# Altium project DDR4.PrjPcb (part 1 of 2)
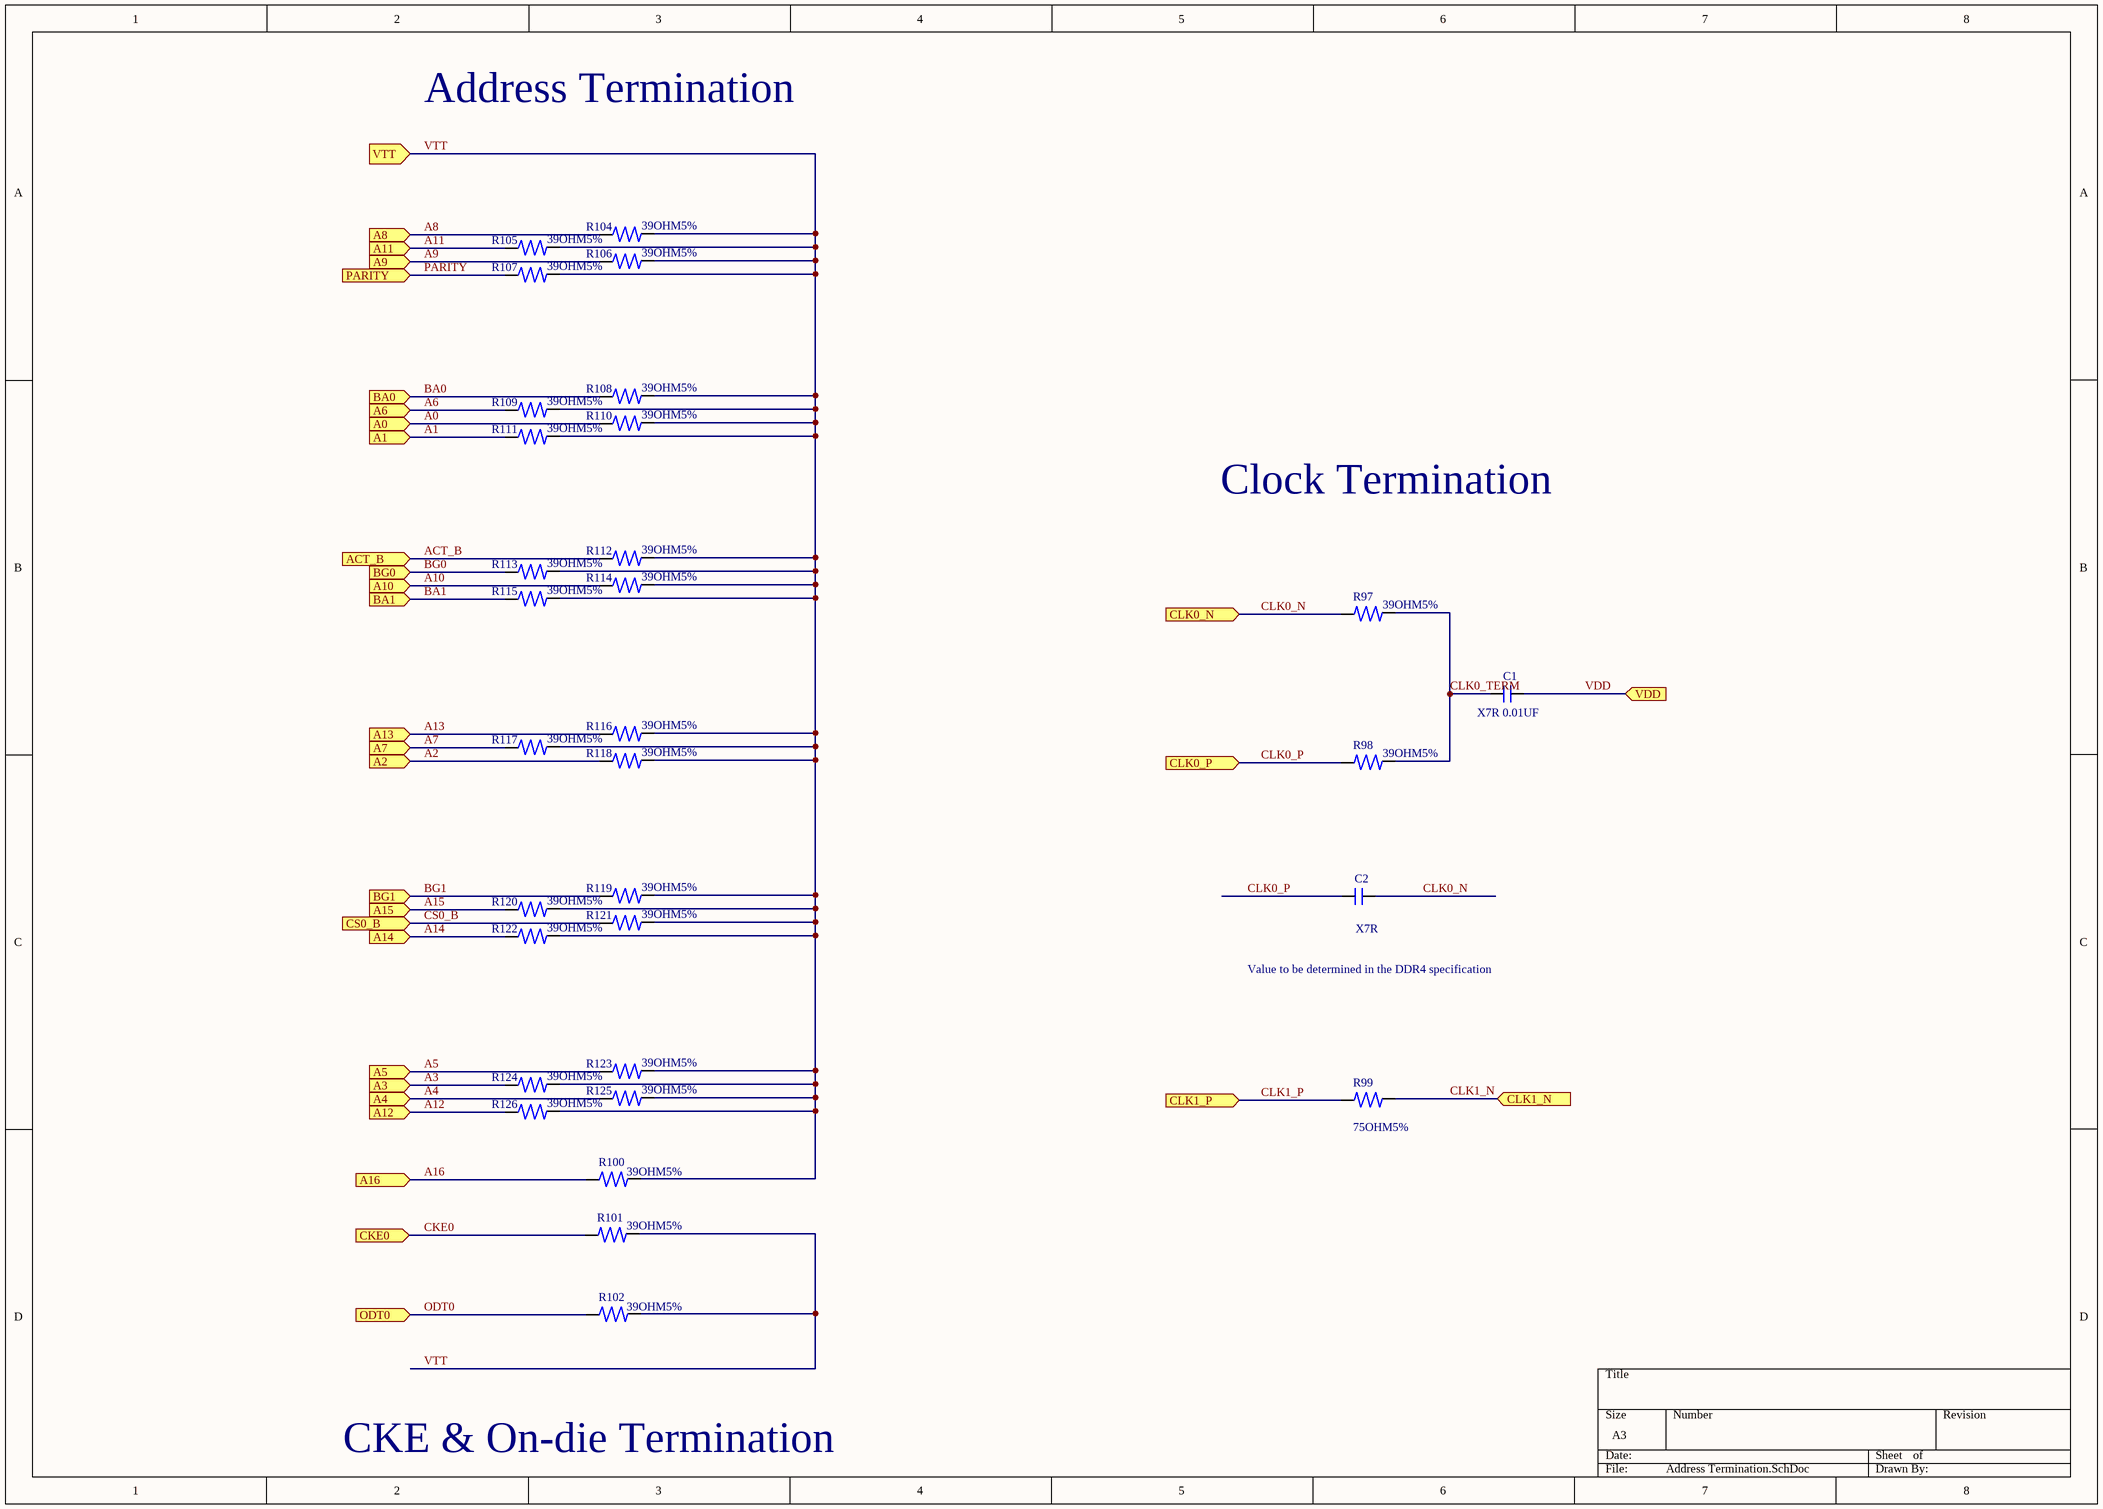
[diagram p0: Address Termination.SchDoc]
7 sheets, 198 parts. Net scope: flat (ports and power ports of the same name join across sheets).
Sheets:
  Address Termination.SchDoc
  Calibration.SchDoc
  Decap.SchDoc
  Memory Chips 5 to 8.SchDoc
  SPD and Alert.SchDoc
  Stub Termination.SchDoc
  Fiducial Markers.SchDoc

## Sheet Address Termination.SchDoc
size A3

### Parts
C1  Capacitance: X7R 0.01UF  [Capacitor 0402]  (hidden comment: Capacitor 0402)
C2  Capacitance: X7R  [Capacitor 0402]  (hidden comment: Capacitor 0402)
R97  Resistance: 39OHM5%  [Resistor 0402]  (hidden comment: Resistor 0402)
R98  Resistance: 39OHM5%  [Resistor 0402]  (hidden comment: Resistor 0402)
R99  Resistance: 75OHM5%  [Resistor 0402]  (hidden comment: Resistor 0402)
R100  Resistance: 39OHM5%  [Resistor 0402]  (hidden comment: Resistor 0402)
R101  Resistance: 39OHM5%  [Resistor 0402]  (hidden comment: Resistor 0402)
R102  Resistance: 39OHM5%  [Resistor 0402]  (hidden comment: Resistor 0402)
R104  Resistance: 39OHM5%  [Resistor 0402]  (hidden comment: Resistor 0402)
R105  Resistance: 39OHM5%  [Resistor 0402]  (hidden comment: Resistor 0402)
R106  Resistance: 39OHM5%  [Resistor 0402]  (hidden comment: Resistor 0402)
R107  Resistance: 39OHM5%  [Resistor 0402]  (hidden comment: Resistor 0402)
R108  Resistance: 39OHM5%  [Resistor 0402]  (hidden comment: Resistor 0402)
R109  Resistance: 39OHM5%  [Resistor 0402]  (hidden comment: Resistor 0402)
R110  Resistance: 39OHM5%  [Resistor 0402]  (hidden comment: Resistor 0402)
R111  Resistance: 39OHM5%  [Resistor 0402]  (hidden comment: Resistor 0402)
R112  Resistance: 39OHM5%  [Resistor 0402]  (hidden comment: Resistor 0402)
R113  Resistance: 39OHM5%  [Resistor 0402]  (hidden comment: Resistor 0402)
R114  Resistance: 39OHM5%  [Resistor 0402]  (hidden comment: Resistor 0402)
R115  Resistance: 39OHM5%  [Resistor 0402]  (hidden comment: Resistor 0402)
R116  Resistance: 39OHM5%  [Resistor 0402]  (hidden comment: Resistor 0402)
R117  Resistance: 39OHM5%  [Resistor 0402]  (hidden comment: Resistor 0402)
R118  Resistance: 39OHM5%  [Resistor 0402]  (hidden comment: Resistor 0402)
R119  Resistance: 39OHM5%  [Resistor 0402]  (hidden comment: Resistor 0402)
R120  Resistance: 39OHM5%  [Resistor 0402]  (hidden comment: Resistor 0402)
R121  Resistance: 39OHM5%  [Resistor 0402]  (hidden comment: Resistor 0402)
R122  Resistance: 39OHM5%  [Resistor 0402]  (hidden comment: Resistor 0402)
R123  Resistance: 39OHM5%  [Resistor 0402]  (hidden comment: Resistor 0402)
R124  Resistance: 39OHM5%  [Resistor 0402]  (hidden comment: Resistor 0402)
R125  Resistance: 39OHM5%  [Resistor 0402]  (hidden comment: Resistor 0402)
R126  Resistance: 39OHM5%  [Resistor 0402]  (hidden comment: Resistor 0402)

### Ports
A0 (in), A1 (in), A2 (in), A3 (in), A4 (in), A5 (in), A6 (in), A7 (in), A8 (in), A9 (in), A10 (in), A11 (in), A12 (in), A13 (in), A14 (in), A15 (in), A16 (in), ACT_B (in), BA0 (in), BA1 (in), BG0 (in), BG1 (in), CKE0 (in), CLK0_N (in), CLK0_P (in), CLK1_N (in), CLK1_P (in), CS0_B (in), ODT0 (in), PARITY (in), VDD (in), VTT (in)

### Nets
A0: R110.1 ; port A0
A1: R111.1 ; port A1
A2: R118.1 ; port A2
A3: R124.1 ; port A3
A4: R125.1 ; port A4
A5: R123.1 ; port A5
A6: R109.1 ; port A6
A7: R117.1 ; port A7
A8: R104.1 ; port A8
A9: R106.1 ; port A9
A10: R114.1 ; port A10
A11: R105.1 ; port A11
A12: R126.1 ; port A12
A13: R116.1 ; port A13
A14: R122.1 ; port A14
A15: R120.1 ; port A15
A16: R100.1 ; port A16
ACT_B: R112.1 ; port ACT_B
BA0: R108.1 ; port BA0
BA1: R115.1 ; port BA1
BG0: R113.1 ; port BG0
BG1: R119.1 ; port BG1
CKE0: R101.1 ; port CKE0
CLK0_N: C2.2 R97.1 ; port CLK0_N
CLK0_P: C2.1 R98.1 ; port CLK0_P
CLK0_TERM: C1.1 R97.2 R98.2
CLK1_N: R99.2 ; port CLK1_N
CLK1_P: R99.1 ; port CLK1_P
CS0_B: R121.1 ; port CS0_B
ODT0: R102.1 ; port ODT0
PARITY: R107.1 ; port PARITY
VDD: C1.2 ; port VDD
VTT: R100.2 R101.2 R102.2 R104.2 R105.2 R106.2 R107.2 R108.2 R109.2 R110.2 R111.2 R112.2 R113.2 R114.2 R115.2 R116.2 R117.2 R118.2 R119.2 R120.2 R121.2 R122.2 R123.2 R124.2 R125.2 R126.2 ; port VTT

### Notes on the sheet
- Address Termination
- Clock Termination
- Value to be determined in the DDR4 specification
- CKE & On-die Termination

### Library data of the parts
C1 C2 = Capacitor 0201: Manufacturer: Vishay; Manufacturer Part Number: CRCW060310K0FKEA; Max Power Dissipation: 100mW; Tolerance: 1%; Voltage Rating: 75V; Temperature Coefficient: 100ppm/°C; Supplier 1: Avnet Europe; Stock 1: 305000; Pricing 1: 5000=0.00444, 10000=0.00432, 20000=0.00421, 30000=0.0041, 40000=0.004 (EUR); Case/Package: 0201; Number of Pins: 2; Weight: 7.1E-05oz; Contact Plating: Tin,Lead; Case Code (Metric): 0603; Case Code (Imperial): 0201; Min Operating Temperature: -55°C; Max Operating Temperature: 155°C; Packaging: Tape and Reel; Package Quantity: 10; Termination: SMD/SMT; Power Rating: 100mW; Composition: Thick Film; Number of Terminations: 2; Military Standard: Not; Voltage Rating (DC): 75V; Features: Automotive AEC-Q200; Length: 1.55mm; Height: 0.45mm; Width: 0.033inch; Depth: 0.85mm; Radiation Hardening: No; REACH SVHC: Unknown; Lead Free: Lead Free
R97-R102 R104-R126 = Resistor 0201: Manufacturer: Vishay; Manufacturer Part Number: CRCW060310K0FKEA; Max Power Dissipation: 100mW; Tolerance: 1%; Voltage Rating: 75V; Temperature Coefficient: 100ppm/°C; Supplier 1: Avnet Europe; Stock 1: 305000; Pricing 1: 5000=0.00444, 10000=0.00432, 20000=0.00421, 30000=0.0041, 40000=0.004 (EUR); Case/Package: 0201; Number of Pins: 2; Weight: 7.1E-05oz; Contact Plating: Tin,Lead; Case Code (Metric): 0603; Case Code (Imperial): 0201; Min Operating Temperature: -55°C; Max Operating Temperature: 155°C; Packaging: Tape and Reel; Package Quantity: 10; Termination: SMD/SMT; Power Rating: 100mW; Composition: Thick Film; Number of Terminations: 2; Military Standard: Not; Voltage Rating (DC): 75V; Features: Automotive AEC-Q200; Length: 1.55mm; Height: 0.45mm; Width: 0.033inch; Depth: 0.85mm; Radiation Hardening: No; REACH SVHC: Unknown; Lead Free: Lead Free; ComponentLink1URL: http://www.vishay.com/docs/20008/dcrcw.pdf?src-supplier=Avnet+Europe; ComponentLink1Description: http://www.vishay.com/docs/20008/dcrcw.pdf?src-supplier=Avnet+Europe; ComponentLink2URL: https://www.verical.com/server-webapp/html/getDatasheet?partID=86831&src-supplier=Verical; ComponentLink2Description: https://www.verical.com/server-webapp/html/getDatasheet?partID=86831&src-supplier=Verical; ComponentLink3URL: http://www.farnell.com/datasheets/2310790.pdf?src-supplier=Allied+Electronics; ComponentLink3Description: http://www.farnell.com/datasheets/2310790.pdf?src-supplier=Allied+Electronics; ComponentLink4URL: http://www.vishay.com/docs/20035/dcrcwe3.pdf?src-supplier=Digi-Key; ComponentLink4Description: http://www.vishay.com/docs/20035/dcrcwe3.pdf?src-supplier=Digi-Key; ComponentLink5URL: http://www.farnell.com/datasheets/2310790.pdf?src-supplier=Mouser; ComponentLink5Description: http://www.farnell.com/datasheets/2310790.pdf?src-supplier=Mouser; ComponentLink6URL: http://www.farnell.com/datasheets/2310790.pdf?src-supplier=Element14; ComponentLink6Description: http://www.farnell.com/datasheets/2310790.pdf?src-supplier=Element14; ComponentLink7URL: http://www.farnell.com/datasheets/2310790.pdf?src-supplier=Avnet; ComponentLink7Description: http://www.farnell.com/datasheets/2310790.pdf?src-supplier=Avnet; ComponentLink8URL: http://www.vishay.com/docs/20035/dcrcwe3.pdf?src-supplier=Future+Electronics; ComponentLink8Description: http://www.vishay.com/docs/20035/dcrcwe3.pdf?src-supplier=Future+Electronics; ComponentLink9URL: http://uk.rs-online.com/webdocs/0d98/0900766b80d98afc.pdf?src-supplier=RSComponents; ComponentLink9Description: http://uk.rs-online.com/webdocs/0d98/0900766b80d98afc.pdf?src-supplier=RSComponents; ComponentLink10URL: http://www.farnell.com/datasheets/2310790.pdf?src-supplier=Distrelec; ComponentLink10Description: http://www.farnell.com/datasheets/2310790.pdf?src-supplier=Distrelec

## Sheet Calibration.SchDoc
size A3
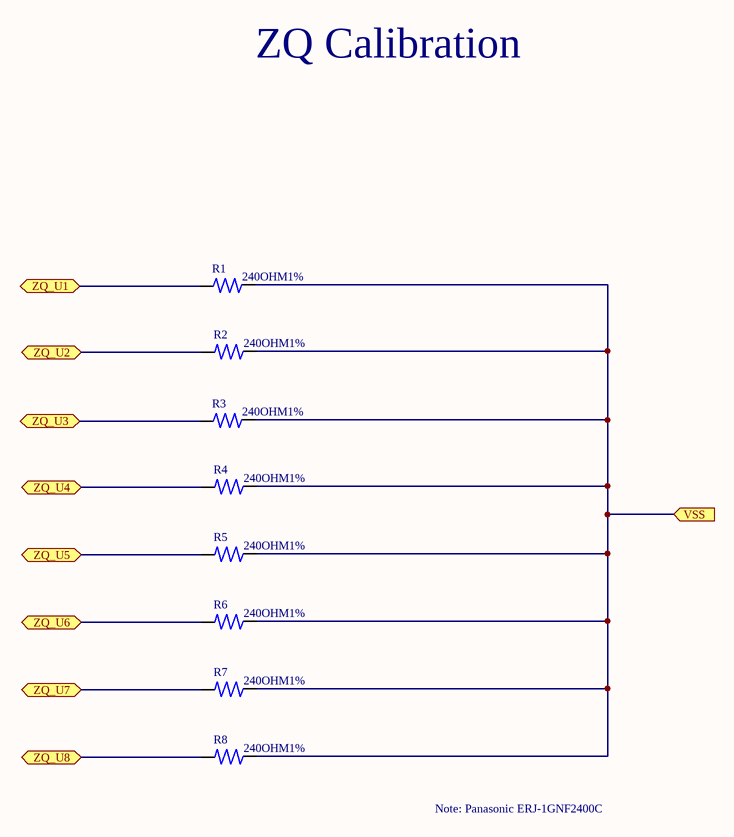
[diagram p1: Calibration.SchDoc]

### Parts
R1  Resistance: 240OHM1%  [Resistor 0402]  (hidden comment: Resistor 0402)
R2  Resistance: 240OHM1%  [Resistor 0402]  (hidden comment: Resistor 0402)
R3  Resistance: 240OHM1%  [Resistor 0402]  (hidden comment: Resistor 0402)
R4  Resistance: 240OHM1%  [Resistor 0402]  (hidden comment: Resistor 0402)
R5  Resistance: 240OHM1%  [Resistor 0402]  (hidden comment: Resistor 0402)
R6  Resistance: 240OHM1%  [Resistor 0402]  (hidden comment: Resistor 0402)
R7  Resistance: 240OHM1%  [Resistor 0402]  (hidden comment: Resistor 0402)
R8  Resistance: 240OHM1%  [Resistor 0402]  (hidden comment: Resistor 0402)

### Ports
VSS (in), ZQ_U1 (bidir), ZQ_U2 (bidir), ZQ_U3 (bidir), ZQ_U4 (bidir), ZQ_U5 (bidir), ZQ_U6 (bidir), ZQ_U7 (bidir), ZQ_U8 (bidir)

### Nets
VSS: R1.2 R2.2 R3.2 R4.2 R5.2 R6.2 R7.2 R8.2 ; port VSS
ZQ_U5: R5.1 ; port ZQ_U5
ZQ_U6: R6.1 ; port ZQ_U6
ZQ_U7: R7.1 ; port ZQ_U7
ZQ_U8: R8.1 ; port ZQ_U8
NetR1_1: R1.1 ; port ZQ_U1
NetR2_1: R2.1 ; port ZQ_U2
NetR3_1: R3.1 ; port ZQ_U3
NetR4_1: R4.1 ; port ZQ_U4

### Notes on the sheet
- ZQ Calibration
- Note: Panasonic ERJ-1GNF2400C

### Library data of the parts
R1-R8 = Resistor 0201: as R97 on sheet Address Termination; Supplier 1: Avnet Europe; Stock 1: 305000; Pricing 1: 5000=0.00444, 10000=0.00432, 20000=0.00421, 30000=0.0041, 40000=0.004 (EUR); Case/Package: 0201; Number of Pins: 2; Weight: 7.1E-05oz; Contact Plating: Tin,Lead; Case Code (Metric): 0603; Case Code (Imperial): 0201; Min Operating Temperature: -55°C; Max Operating Temperature: 155°C; Packaging: Tape and Reel; Package Quantity: 10; Termination: SMD/SMT; Power Rating: 100mW; Composition: Thick Film; Number of Terminations: 2; Military Standard: Not; Voltage Rating (DC): 75V; Features: Automotive AEC-Q200; Length: 1.55mm; Height: 0.45mm; Width: 0.033inch; Depth: 0.85mm; Radiation Hardening: No; REACH SVHC: Unknown; Lead Free: Lead Free; ComponentLink1URL: http://www.vishay.com/docs/20008/dcrcw.pdf?src-supplier=Avnet+Europe; ComponentLink1Description: http://www.vishay.com/docs/20008/dcrcw.pdf?src-supplier=Avnet+Europe; ComponentLink2URL: https://www.verical.com/server-webapp/html/getDatasheet?partID=86831&src-supplier=Verical; ComponentLink2Description: https://www.verical.com/server-webapp/html/getDatasheet?partID=86831&src-supplier=Verical; ComponentLink3URL: http://www.farnell.com/datasheets/2310790.pdf?src-supplier=Allied+Electronics; ComponentLink3Description: http://www.farnell.com/datasheets/2310790.pdf?src-supplier=Allied+Electronics; ComponentLink4URL: http://www.vishay.com/docs/20035/dcrcwe3.pdf?src-supplier=Digi-Key; ComponentLink4Description: http://www.vishay.com/docs/20035/dcrcwe3.pdf?src-supplier=Digi-Key; ComponentLink5URL: http://www.farnell.com/datasheets/2310790.pdf?src-supplier=Mouser; ComponentLink5Description: http://www.farnell.com/datasheets/2310790.pdf?src-supplier=Mouser; ComponentLink6URL: http://www.farnell.com/datasheets/2310790.pdf?src-supplier=Element14; ComponentLink6Description: http://www.farnell.com/datasheets/2310790.pdf?src-supplier=Element14; ComponentLink7URL: http://www.farnell.com/datasheets/2310790.pdf?src-supplier=Avnet; ComponentLink7Description: http://www.farnell.com/datasheets/2310790.pdf?src-supplier=Avnet; ComponentLink8URL: http://www.vishay.com/docs/20035/dcrcwe3.pdf?src-supplier=Future+Electronics; ComponentLink8Description: http://www.vishay.com/docs/20035/dcrcwe3.pdf?src-supplier=Future+Electronics; ComponentLink9URL: http://uk.rs-online.com/webdocs/0d98/0900766b80d98afc.pdf?src-supplier=RSComponents; ComponentLink9Description: http://uk.rs-online.com/webdocs/0d98/0900766b80d98afc.pdf?src-supplier=RSComponents; ComponentLink10URL: http://www.farnell.com/datasheets/2310790.pdf?src-supplier=Distrelec; ComponentLink10Description: http://www.farnell.com/datasheets/2310790.pdf?src-supplier=Distrelec

## Sheet Decap.SchDoc
size A3
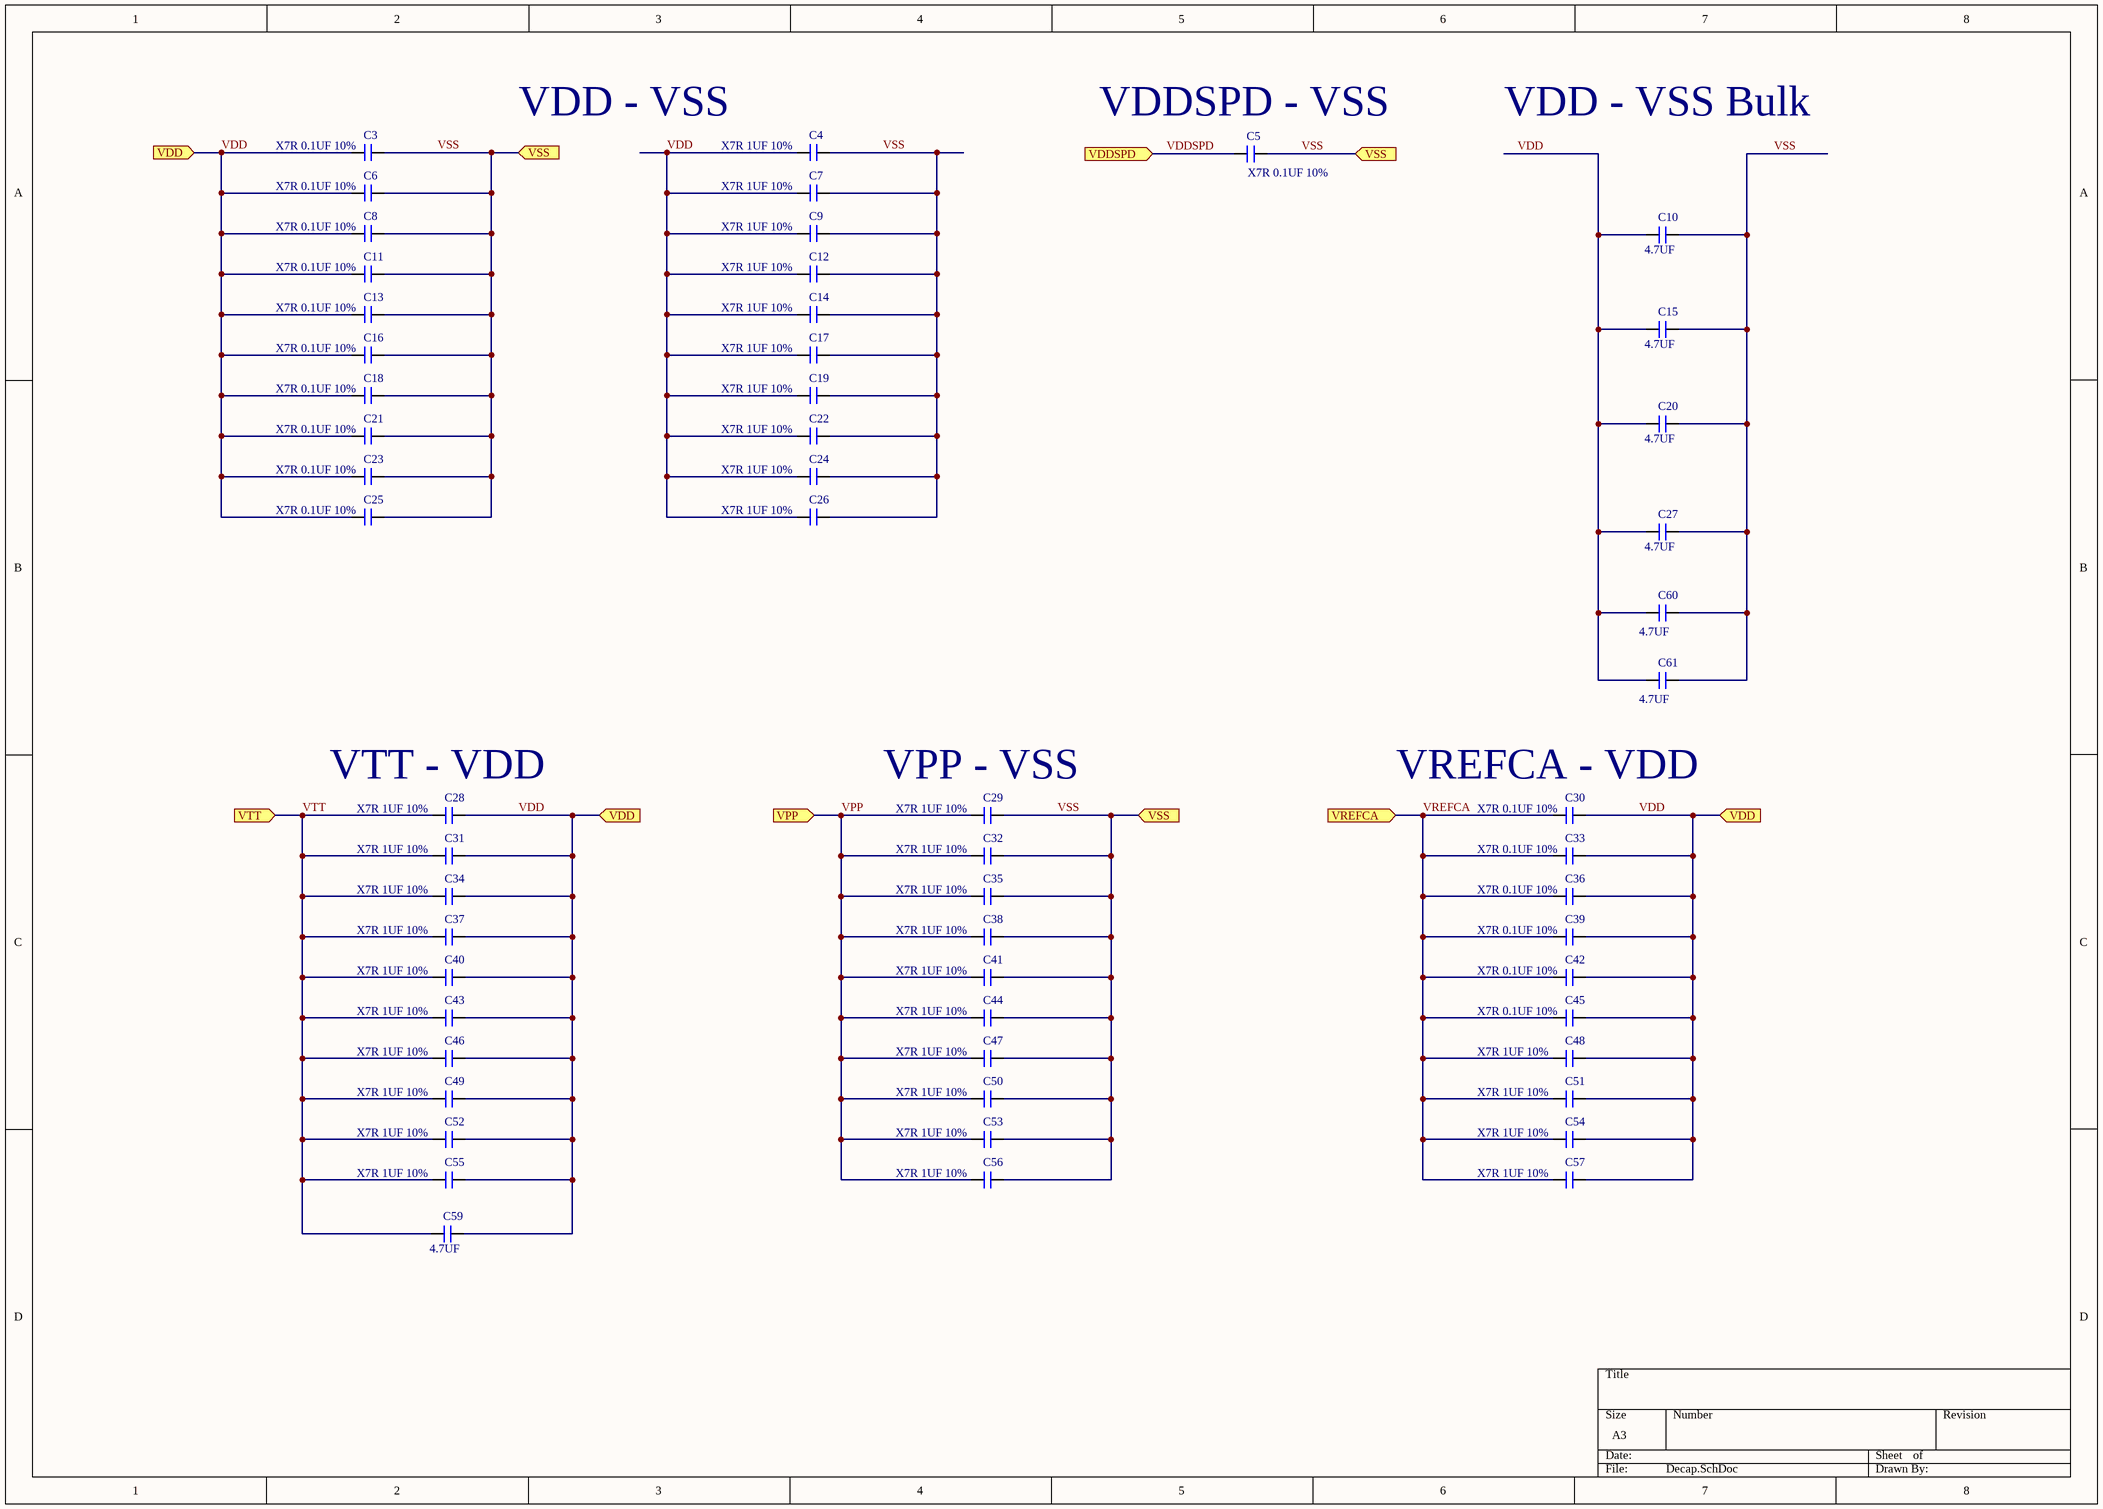
[diagram p2: Decap.SchDoc]

### Parts
C3  Capacitance: X7R 0.1UF 10%  [Capacitor 0402]  (hidden comment: Capacitor 0402)
C4  Capacitance: X7R 1UF 10%  [Capacitor 0402]  (hidden comment: Capacitor 0402)
C5  Capacitance: X7R 0.1UF 10%  [Capacitor 0402]  (hidden comment: Capacitor 0402)
C6  Capacitance: X7R 0.1UF 10%  [Capacitor 0402]  (hidden comment: Capacitor 0402)
C7  Capacitance: X7R 1UF 10%  [Capacitor 0402]  (hidden comment: Capacitor 0402)
C8  Capacitance: X7R 0.1UF 10%  [Capacitor 0402]  (hidden comment: Capacitor 0402)
C9  Capacitance: X7R 1UF 10%  [Capacitor 0402]  (hidden comment: Capacitor 0402)
C10  Capacitance: 4.7UF  [Capacitor 0603]  (hidden comment: Capacitor 0603)
C11  Capacitance: X7R 0.1UF 10%  [Capacitor 0402]  (hidden comment: Capacitor 0402)
C12  Capacitance: X7R 1UF 10%  [Capacitor 0402]  (hidden comment: Capacitor 0402)
C13  Capacitance: X7R 0.1UF 10%  [Capacitor 0402]  (hidden comment: Capacitor 0402)
C14  Capacitance: X7R 1UF 10%  [Capacitor 0402]  (hidden comment: Capacitor 0402)
C15  Capacitance: 4.7UF  [Capacitor 0603]  (hidden comment: Capacitor 0603)
C16  Capacitance: X7R 0.1UF 10%  [Capacitor 0402]  (hidden comment: Capacitor 0402)
C17  Capacitance: X7R 1UF 10%  [Capacitor 0402]  (hidden comment: Capacitor 0402)
C18  Capacitance: X7R 0.1UF 10%  [Capacitor 0402]  (hidden comment: Capacitor 0402)
C19  Capacitance: X7R 1UF 10%  [Capacitor 0402]  (hidden comment: Capacitor 0402)
C20  Capacitance: 4.7UF  [Capacitor 0603]  (hidden comment: Capacitor 0603)
C21  Capacitance: X7R 0.1UF 10%  [Capacitor 0402]  (hidden comment: Capacitor 0402)
C22  Capacitance: X7R 1UF 10%  [Capacitor 0402]  (hidden comment: Capacitor 0402)
C23  Capacitance: X7R 0.1UF 10%  [Capacitor 0402]  (hidden comment: Capacitor 0402)
C24  Capacitance: X7R 1UF 10%  [Capacitor 0402]  (hidden comment: Capacitor 0402)
C25  Capacitance: X7R 0.1UF 10%  [Capacitor 0402]  (hidden comment: Capacitor 0402)
C26  Capacitance: X7R 1UF 10%  [Capacitor 0402]  (hidden comment: Capacitor 0402)
C27  Capacitance: 4.7UF  [Capacitor 0603]  (hidden comment: Capacitor 0603)
C28  Capacitance: X7R 1UF 10%  [Capacitor 0402]  (hidden comment: Capacitor 0402)
C29  Capacitance: X7R 1UF 10%  [Capacitor 0402]  (hidden comment: Capacitor 0402)
C30  Capacitance: X7R 0.1UF 10%  [Capacitor 0402]  (hidden comment: Capacitor 0402)
C31  Capacitance: X7R 1UF 10%  [Capacitor 0402]  (hidden comment: Capacitor 0402)
C32  Capacitance: X7R 1UF 10%  [Capacitor 0402]  (hidden comment: Capacitor 0402)
C33  Capacitance: X7R 0.1UF 10%  [Capacitor 0402]  (hidden comment: Capacitor 0402)
C34  Capacitance: X7R 1UF 10%  [Capacitor 0402]  (hidden comment: Capacitor 0402)
C35  Capacitance: X7R 1UF 10%  [Capacitor 0402]  (hidden comment: Capacitor 0402)
C36  Capacitance: X7R 0.1UF 10%  [Capacitor 0402]  (hidden comment: Capacitor 0402)
C37  Capacitance: X7R 1UF 10%  [Capacitor 0402]  (hidden comment: Capacitor 0402)
C38  Capacitance: X7R 1UF 10%  [Capacitor 0402]  (hidden comment: Capacitor 0402)
C39  Capacitance: X7R 0.1UF 10%  [Capacitor 0402]  (hidden comment: Capacitor 0402)
C40  Capacitance: X7R 1UF 10%  [Capacitor 0402]  (hidden comment: Capacitor 0402)
C41  Capacitance: X7R 1UF 10%  [Capacitor 0402]  (hidden comment: Capacitor 0402)
C42  Capacitance: X7R 0.1UF 10%  [Capacitor 0402]  (hidden comment: Capacitor 0402)
C43  Capacitance: X7R 1UF 10%  [Capacitor 0402]  (hidden comment: Capacitor 0402)
C44  Capacitance: X7R 1UF 10%  [Capacitor 0402]  (hidden comment: Capacitor 0402)
C45  Capacitance: X7R 0.1UF 10%  [Capacitor 0402]  (hidden comment: Capacitor 0402)
C46  Capacitance: X7R 1UF 10%  [Capacitor 0402]  (hidden comment: Capacitor 0402)
C47  Capacitance: X7R 1UF 10%  [Capacitor 0402]  (hidden comment: Capacitor 0402)
C48  Capacitance: X7R 1UF 10%  [Capacitor 0402]  (hidden comment: Capacitor 0402)
C49  Capacitance: X7R 1UF 10%  [Capacitor 0402]  (hidden comment: Capacitor 0402)
C50  Capacitance: X7R 1UF 10%  [Capacitor 0402]  (hidden comment: Capacitor 0402)
C51  Capacitance: X7R 1UF 10%  [Capacitor 0402]  (hidden comment: Capacitor 0402)
C52  Capacitance: X7R 1UF 10%  [Capacitor 0402]  (hidden comment: Capacitor 0402)
C53  Capacitance: X7R 1UF 10%  [Capacitor 0402]  (hidden comment: Capacitor 0402)
C54  Capacitance: X7R 1UF 10%  [Capacitor 0402]  (hidden comment: Capacitor 0402)
C55  Capacitance: X7R 1UF 10%  [Capacitor 0402]  (hidden comment: Capacitor 0402)
C56  Capacitance: X7R 1UF 10%  [Capacitor 0402]  (hidden comment: Capacitor 0402)
C57  Capacitance: X7R 1UF 10%  [Capacitor 0402]  (hidden comment: Capacitor 0402)
C59  Capacitance: 4.7UF  [Capacitor 0603]  (hidden comment: Capacitor 0603)
C60  Capacitance: 4.7UF  [Capacitor 0603]  (hidden comment: Capacitor 0603)
C61  Capacitance: 4.7UF  [Capacitor 0603]  (hidden comment: Capacitor 0603)

### Ports
VDD (in), VDDSPD (in), VPP (in), VREFCA (in), VSS (in), VTT (in)

### Nets
VDD: C3.1 C4.1 C6.1 C7.1 C8.1 C9.1 C10.1 C11.1 C12.1 C13.1 C14.1 C15.1 C16.1 C17.1 C18.1 C19.1 C20.1 C21.1 C22.1 C23.1 C24.1 C25.1 C26.1 C27.1 C28.2 C30.2 C31.2 C33.2 C34.2 C36.2 C37.2 C39.2 C40.2 C42.2 C43.2 C45.2 C46.2 C48.2 C49.2 C51.2 C52.2 C54.2 C55.2 C57.2 C59.2 C60.1 C61.1 ; port VDD
VDDSPD: C5.1 ; port VDDSPD
VPP: C29.1 C32.1 C35.1 C38.1 C41.1 C44.1 C47.1 C50.1 C53.1 C56.1 ; port VPP
VREFCA: C30.1 C33.1 C36.1 C39.1 C42.1 C45.1 C48.1 C51.1 C54.1 C57.1 ; port VREFCA
VSS: C3.2 C4.2 C5.2 C6.2 C7.2 C8.2 C9.2 C10.2 C11.2 C12.2 C13.2 C14.2 C15.2 C16.2 C17.2 C18.2 C19.2 C20.2 C21.2 C22.2 C23.2 C24.2 C25.2 C26.2 C27.2 C29.2 C32.2 C35.2 C38.2 C41.2 C44.2 C47.2 C50.2 C53.2 C56.2 C60.2 C61.2 ; port VSS
VTT: C28.1 C31.1 C34.1 C37.1 C40.1 C43.1 C46.1 C49.1 C52.1 C55.1 C59.1 ; port VTT

### Notes on the sheet
- VDD - VSS
- (near C5) VDDSPD - VSS
- VDD - VSS Bulk
- (near C28) VTT - VDD
- (near C29) VPP - VSS
- (near C30) VREFCA - VDD

### Library data of the parts
C3-C9 C11-C14 C16-C19 C21-C26 C28-C57 = Capacitor 0201: as C1 on sheet Address Termination; Supplier 1: Avnet Europe; Stock 1: 305000; Pricing 1: 5000=0.00444, 10000=0.00432, 20000=0.00421, 30000=0.0041, 40000=0.004 (EUR); Case/Package: 0201; Number of Pins: 2; Weight: 7.1E-05oz; Contact Plating: Tin,Lead; Case Code (Metric): 0603; Case Code (Imperial): 0201; Min Operating Temperature: -55°C; Max Operating Temperature: 155°C; Packaging: Tape and Reel; Package Quantity: 10; Termination: SMD/SMT; Power Rating: 100mW; Composition: Thick Film; Number of Terminations: 2; Military Standard: Not; Voltage Rating (DC): 75V; Features: Automotive AEC-Q200; Length: 1.55mm; Height: 0.45mm; Width: 0.033inch; Depth: 0.85mm; Radiation Hardening: No; REACH SVHC: Unknown; Lead Free: Lead Free
C10 C15 C20 C27 C59-C61 = Capacitor 0603: Manufacturer: Vishay; Manufacturer Part Number: CRCW060310K0FKEA; Max Power Dissipation: 100mW; Tolerance: 1%; Voltage Rating: 75V; Temperature Coefficient: 100ppm/°C; Supplier 1: Avnet Europe; Stock 1: 305000; Pricing 1: 5000=0.00444, 10000=0.00432, 20000=0.00421, 30000=0.0041, 40000=0.004 (EUR); Case/Package: 0603; Number of Pins: 2; Weight: 7.1E-05oz; Contact Plating: Tin,Lead; Case Code (Metric): 1608; Case Code (Imperial): 0603; Min Operating Temperature: -55°C; Max Operating Temperature: 155°C; Packaging: Tape and Reel; Package Quantity: 10; Termination: SMD/SMT; Power Rating: 100mW; Composition: Thick Film; Number of Terminations: 2; Military Standard: Not; Voltage Rating (DC): 75V; Features: Automotive AEC-Q200; Length: 1.55mm; Height: 0.45mm; Width: 0.033inch; Depth: 0.85mm; Radiation Hardening: No; REACH SVHC: Unknown; Lead Free: Lead Free

## Sheet Memory Chips 5 to 8.SchDoc
size A3
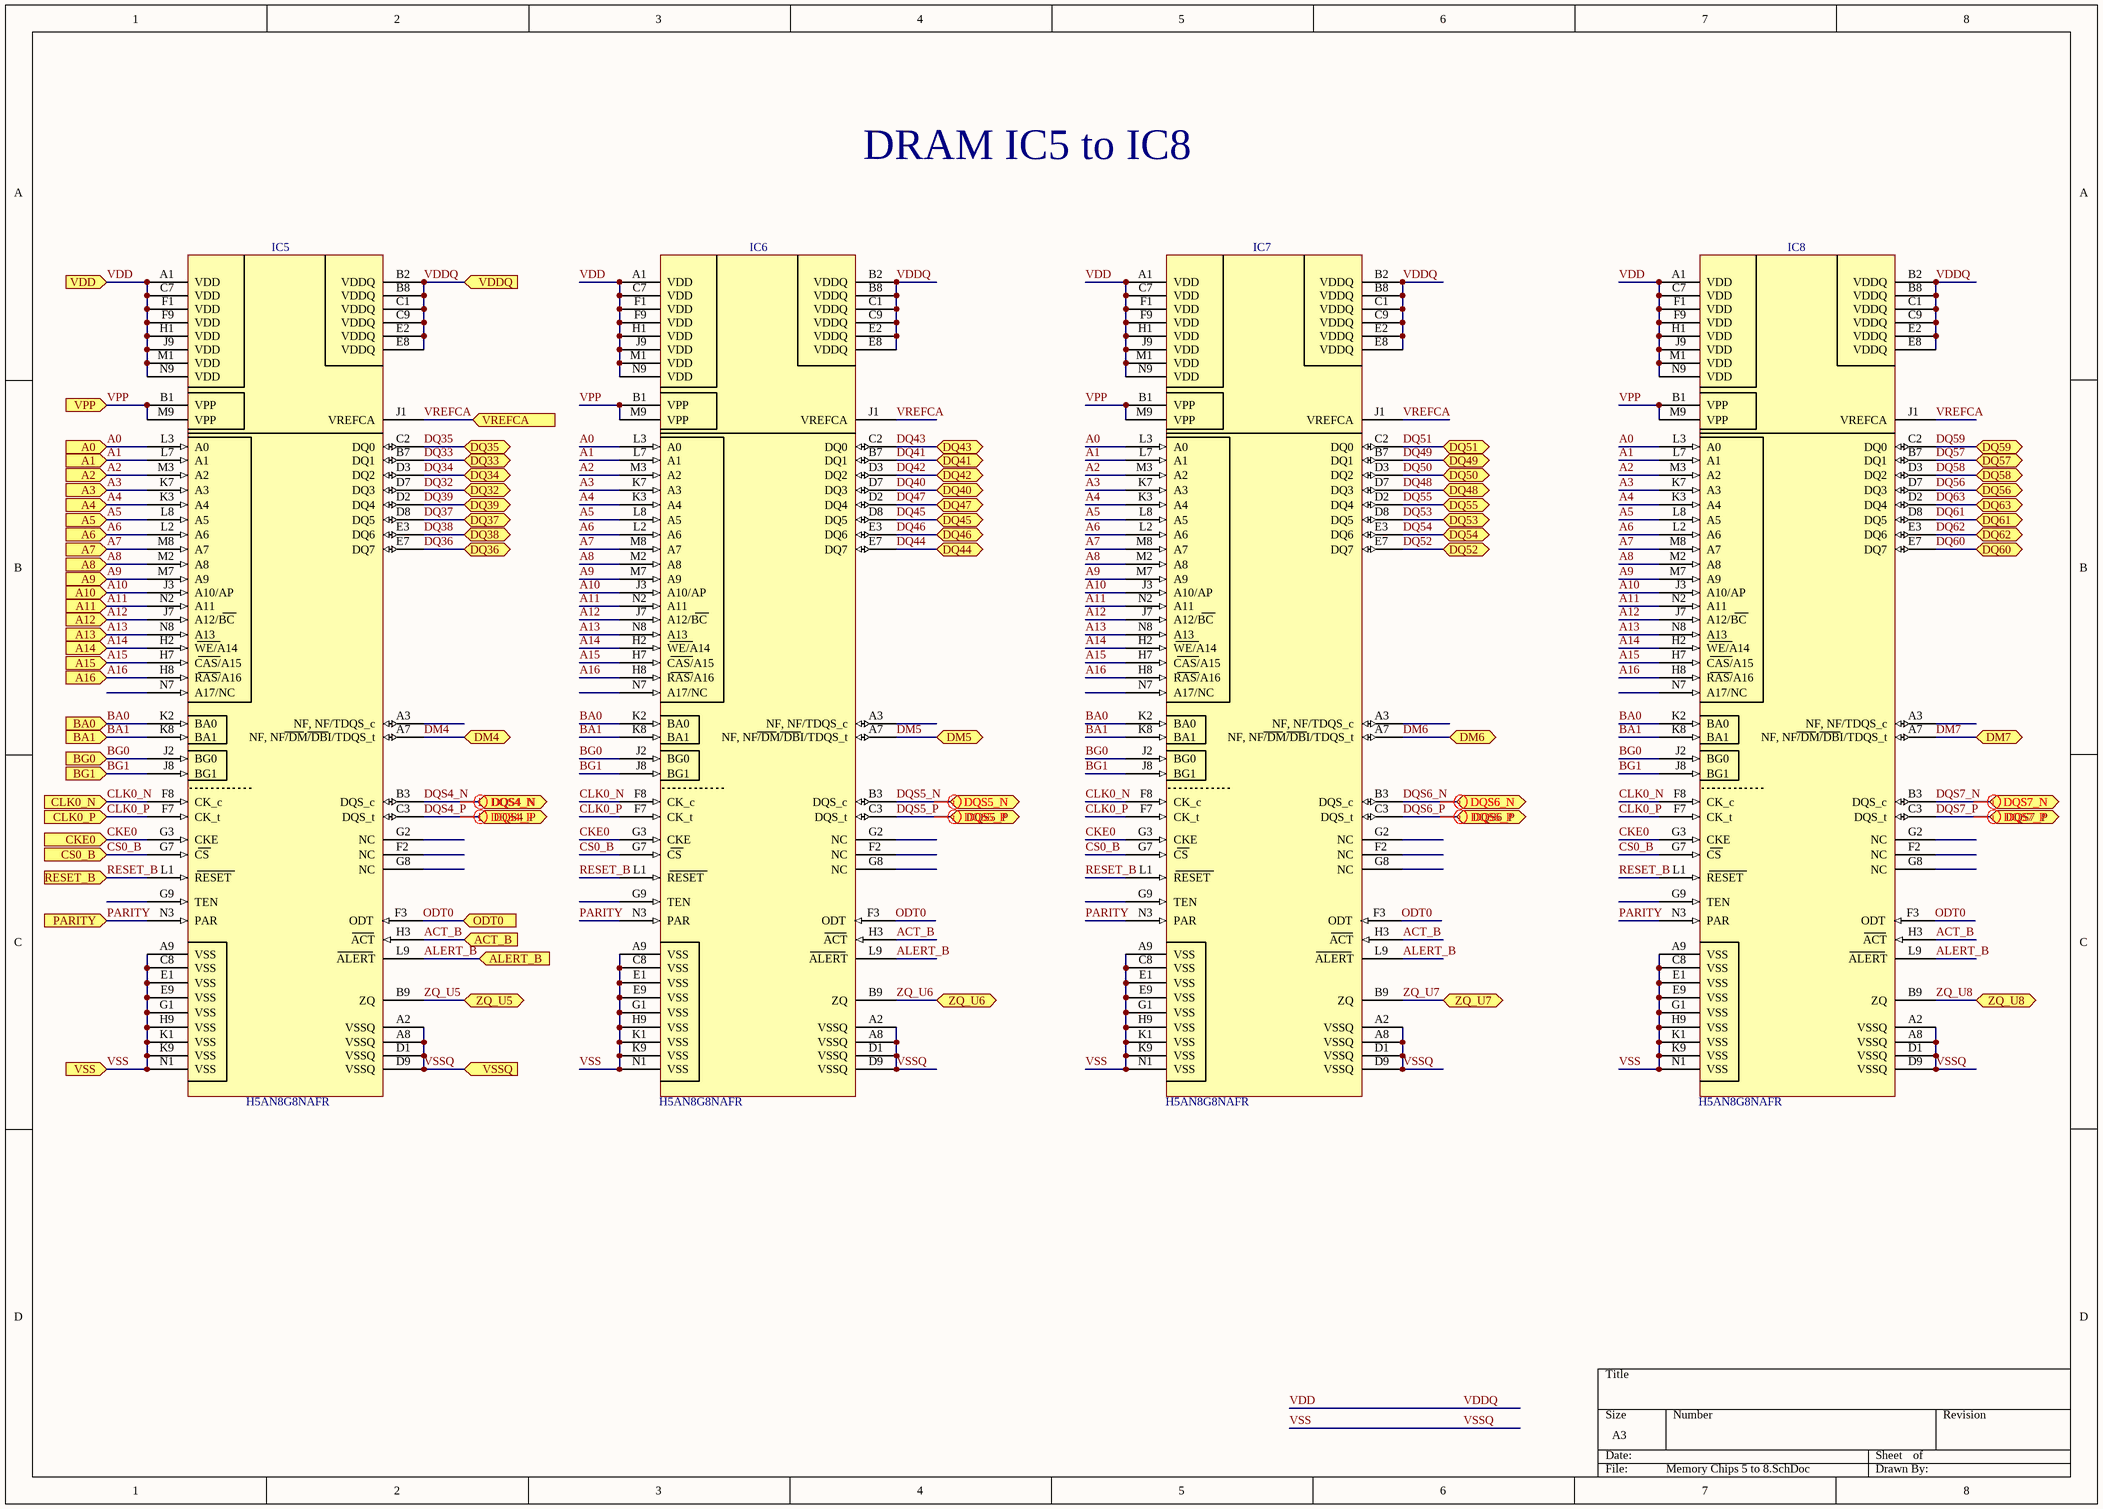
[diagram p3: Memory Chips 5 to 8.SchDoc]

### Parts
IC5  H5AN8G8NAFR  [H5AN8G8NAFR]
IC6  H5AN8G8NAFR  [H5AN8G8NAFR]
IC7  H5AN8G8NAFR  [H5AN8G8NAFR]
IC8  H5AN8G8NAFR  [H5AN8G8NAFR]

### Ports
A0 (in), A1 (in), A2 (in), A3 (in), A4 (in), A5 (in), A6 (in), A7 (in), A8 (in), A9 (in), A10 (in), A11 (in), A12 (in), A13 (in), A14 (in), A15 (in), A16 (in), ACT_B (in), ALERT_B (in), BA0 (in), BA1 (in), BG0 (in), BG1 (in), CKE0 (in), CLK0_N (in), CLK0_P (in), CS0_B (in), DM4 (bidir), DM5 (bidir), DM6 (bidir), DM7 (bidir), DQ32 (bidir), DQ33 (bidir), DQ34 (bidir), DQ35 (bidir), DQ36 (bidir), DQ37 (bidir), DQ38 (bidir), DQ39 (bidir), DQ40 (bidir), DQ41 (bidir), DQ42 (bidir), DQ43 (bidir), DQ44 (bidir), DQ45 (bidir), DQ46 (bidir), DQ47 (bidir), DQ48 (bidir), DQ49 (bidir), DQ50 (bidir), DQ51 (bidir), DQ52 (bidir), DQ53 (bidir), DQ54 (bidir), DQ55 (bidir), DQ56 (bidir), DQ57 (bidir), DQ58 (bidir), DQ59 (bidir), DQ60 (bidir), DQ61 (bidir), DQ62 (bidir), DQ63 (bidir), DQS4_N (bidir), DQS4_P (bidir), DQS5_N (bidir), DQS5_P (bidir), DQS6_N (bidir), DQS6_P (bidir), DQS7_N (bidir), DQS7_P (bidir), ODT0 (in), PARITY (in), RESET_B (in), VDD (in), VDDQ (in), VPP (in), VREFCA (in), VSS (in), VSSQ (in), ZQ_U5 (bidir), ZQ_U6 (bidir), ZQ_U7 (bidir), ZQ_U8 (bidir)

### Nets
A0: IC5.L3(A0) IC6.L3(A0) IC7.L3(A0) IC8.L3(A0) ; port A0
A1: IC5.L7(A1) IC6.L7(A1) IC7.L7(A1) IC8.L7(A1) ; port A1
A2: IC5.M3(A2) IC6.M3(A2) IC7.M3(A2) IC8.M3(A2) ; port A2
A3: IC5.K7(A3) IC6.K7(A3) IC7.K7(A3) IC8.K7(A3) ; port A3
A4: IC5.K3(A4) IC6.K3(A4) IC7.K3(A4) IC8.K3(A4) ; port A4
A5: IC5.L8(A5) IC6.L8(A5) IC7.L8(A5) IC8.L8(A5) ; port A5
A6: IC5.L2(A6) IC6.L2(A6) IC7.L2(A6) IC8.L2(A6) ; port A6
A7: IC5.M8(A7) IC6.M8(A7) IC7.M8(A7) IC8.M8(A7) ; port A7
A8: IC5.M2(A8) IC6.M2(A8) IC7.M2(A8) IC8.M2(A8) ; port A8
A9: IC5.M7(A9) IC6.M7(A9) IC7.M7(A9) IC8.M7(A9) ; port A9
A10: IC5.J3(A10/AP) IC6.J3(A10/AP) IC7.J3(A10/AP) IC8.J3(A10/AP) ; port A10
A11: IC5.N2(A11) IC6.N2(A11) IC7.N2(A11) IC8.N2(A11) ; port A11
A12: IC5.J7(A12/BC) IC6.J7(A12/BC) IC7.J7(A12/BC) IC8.J7(A12/BC) ; port A12
A13: IC5.N8(A13) IC6.N8(A13) IC7.N8(A13) IC8.N8(A13) ; port A13
A14: IC5.H2(WE/A14) IC6.H2(WE/A14) IC7.H2(WE/A14) IC8.H2(WE/A14) ; port A14
A15: IC5.H7(CAS/A15) IC6.H7(CAS/A15) IC7.H7(CAS/A15) IC8.H7(CAS/A15) ; port A15
A16: IC5.H8(RAS/A16) IC6.H8(RAS/A16) IC7.H8(RAS/A16) IC8.H8(RAS/A16) ; port A16
ACT_B: IC5.H3(ACT) IC6.H3(ACT) IC7.H3(ACT) IC8.H3(ACT) ; port ACT_B
ALERT_B: IC5.L9(ALERT) IC6.L9(ALERT) IC7.L9(ALERT) IC8.L9(ALERT) ; port ALERT_B
BA0: IC5.K2(BA0) IC6.K2(BA0) IC7.K2(BA0) IC8.K2(BA0) ; port BA0
BA1: IC5.K8(BA1) IC6.K8(BA1) IC7.K8(BA1) IC8.K8(BA1) ; port BA1
BG0: IC5.J2(BG0) IC6.J2(BG0) IC7.J2(BG0) IC8.J2(BG0) ; port BG0
BG1: IC5.J8(BG1) IC6.J8(BG1) IC7.J8(BG1) IC8.J8(BG1) ; port BG1
CKE0: IC5.G3(CKE) IC6.G3(CKE) IC7.G3(CKE) IC8.G3(CKE) ; port CKE0
CLK0_N: IC5.F8(CK_c) IC6.F8(CK_c) IC7.F8(CK_c) IC8.F8(CK_c) ; port CLK0_N
CLK0_P: IC5.F7(CK_t) IC6.F7(CK_t) IC7.F7(CK_t) IC8.F7(CK_t) ; port CLK0_P
CS0_B: IC5.G7(CS) IC6.G7(CS) IC7.G7(CS) IC8.G7(CS) ; port CS0_B
DM4: IC5.A7(NF,_NF/DM/DBI/TDQS_t) ; port DM4
DM5: IC6.A7(NF,_NF/DM/DBI/TDQS_t) ; port DM5
DM6: IC7.A7(NF,_NF/DM/DBI/TDQS_t) ; port DM6
DM7: IC8.A7(NF,_NF/DM/DBI/TDQS_t) ; port DM7
DQ32: IC5.D7(DQ3) ; port DQ32
DQ33: IC5.B7(DQ1) ; port DQ33
DQ34: IC5.D3(DQ2) ; port DQ34
DQ35: IC5.C2(DQ0) ; port DQ35
DQ36: IC5.E7(DQ7) ; port DQ36
DQ37: IC5.D8(DQ5) ; port DQ37
DQ38: IC5.E3(DQ6) ; port DQ38
DQ39: IC5.D2(DQ4) ; port DQ39
DQ40: IC6.D7(DQ3) ; port DQ40
DQ41: IC6.B7(DQ1) ; port DQ41
DQ42: IC6.D3(DQ2) ; port DQ42
DQ43: IC6.C2(DQ0) ; port DQ43
DQ44: IC6.E7(DQ7) ; port DQ44
DQ45: IC6.D8(DQ5) ; port DQ45
DQ46: IC6.E3(DQ6) ; port DQ46
DQ47: IC6.D2(DQ4) ; port DQ47
DQ48: IC7.D7(DQ3) ; port DQ48
DQ49: IC7.B7(DQ1) ; port DQ49
DQ50: IC7.D3(DQ2) ; port DQ50
DQ51: IC7.C2(DQ0) ; port DQ51
DQ52: IC7.E7(DQ7) ; port DQ52
DQ53: IC7.D8(DQ5) ; port DQ53
DQ54: IC7.E3(DQ6) ; port DQ54
DQ55: IC7.D2(DQ4) ; port DQ55
DQ56: IC8.D7(DQ3) ; port DQ56
DQ57: IC8.B7(DQ1) ; port DQ57
DQ58: IC8.D3(DQ2) ; port DQ58
DQ59: IC8.C2(DQ0) ; port DQ59
DQ60: IC8.E7(DQ7) ; port DQ60
DQ61: IC8.D8(DQ5) ; port DQ61
DQ62: IC8.E3(DQ6) ; port DQ62
DQ63: IC8.D2(DQ4) ; port DQ63
DQS4_N: IC5.B3(DQS_c) ; port DQS4_N
DQS4_P: IC5.C3(DQS_t) ; port DQS4_P
DQS5_N: IC6.B3(DQS_c) ; port DQS5_N
DQS5_P: IC6.C3(DQS_t) ; port DQS5_P
DQS6_N: IC7.B3(DQS_c) ; port DQS6_N
DQS6_P: IC7.C3(DQS_t) ; port DQS6_P
DQS7_N: IC8.B3(DQS_c) ; port DQS7_N
DQS7_P: IC8.C3(DQS_t) ; port DQS7_P
ODT0: IC5.F3(ODT) IC6.F3(ODT) IC7.F3(ODT) IC8.F3(ODT) ; port ODT0
PARITY: IC5.N3(PAR) IC6.N3(PAR) IC7.N3(PAR) IC8.N3(PAR) ; port PARITY
RESET_B: IC5.L1(RESET) IC6.L1(RESET) IC7.L1(RESET) IC8.L1(RESET) ; port RESET_B
VDD: IC5.A1(VDD) IC5.B2(VDDQ) IC5.B8(VDDQ) IC5.C1(VDDQ) IC5.C7(VDD) IC5.C9(VDDQ) IC5.E2(VDDQ) IC5.E8(VDDQ) IC5.F1(VDD) IC5.F9(VDD) IC5.H1(VDD) IC5.J9(VDD) IC5.M1(VDD) IC5.N9(VDD) IC6.A1(VDD) IC6.B2(VDDQ) IC6.B8(VDDQ) IC6.C1(VDDQ) IC6.C7(VDD) IC6.C9(VDDQ) IC6.E2(VDDQ) IC6.E8(VDDQ) IC6.F1(VDD) IC6.F9(VDD) IC6.H1(VDD) IC6.J9(VDD) IC6.M1(VDD) IC6.N9(VDD) IC7.A1(VDD) IC7.B2(VDDQ) IC7.B8(VDDQ) IC7.C1(VDDQ) IC7.C7(VDD) IC7.C9(VDDQ) IC7.E2(VDDQ) IC7.E8(VDDQ) IC7.F1(VDD) IC7.F9(VDD) IC7.H1(VDD) IC7.J9(VDD) IC7.M1(VDD) IC7.N9(VDD) IC8.A1(VDD) IC8.B2(VDDQ) IC8.B8(VDDQ) IC8.C1(VDDQ) IC8.C7(VDD) IC8.C9(VDDQ) IC8.E2(VDDQ) IC8.E8(VDDQ) IC8.F1(VDD) IC8.F9(VDD) IC8.H1(VDD) IC8.J9(VDD) IC8.M1(VDD) IC8.N9(VDD) ; port VDD, port VDDQ  [also labelled VDDQ]
VPP: IC5.B1(VPP) IC5.M9(VPP) IC6.B1(VPP) IC6.M9(VPP) IC7.B1(VPP) IC7.M9(VPP) IC8.B1(VPP) IC8.M9(VPP) ; port VPP
VREFCA: IC5.J1(VREFCA) IC6.J1(VREFCA) IC7.J1(VREFCA) IC8.J1(VREFCA) ; port VREFCA
VSS: IC5.A2(VSSQ) IC5.A8(VSSQ) IC5.A9(VSS) IC5.C8(VSS) IC5.D1(VSSQ) IC5.D9(VSSQ) IC5.E1(VSS) IC5.E9(VSS) IC5.G1(VSS) IC5.H9(VSS) IC5.K1(VSS) IC5.K9(VSS) IC5.N1(VSS) IC6.A2(VSSQ) IC6.A8(VSSQ) IC6.A9(VSS) IC6.C8(VSS) IC6.D1(VSSQ) IC6.D9(VSSQ) IC6.E1(VSS) IC6.E9(VSS) IC6.G1(VSS) IC6.H9(VSS) IC6.K1(VSS) IC6.K9(VSS) IC6.N1(VSS) IC7.A2(VSSQ) IC7.A8(VSSQ) IC7.A9(VSS) IC7.C8(VSS) IC7.D1(VSSQ) IC7.D9(VSSQ) IC7.E1(VSS) IC7.E9(VSS) IC7.G1(VSS) IC7.H9(VSS) IC7.K1(VSS) IC7.K9(VSS) IC7.N1(VSS) IC8.A2(VSSQ) IC8.A8(VSSQ) IC8.A9(VSS) IC8.C8(VSS) IC8.D1(VSSQ) IC8.D9(VSSQ) IC8.E1(VSS) IC8.E9(VSS) IC8.G1(VSS) IC8.H9(VSS) IC8.K1(VSS) IC8.K9(VSS) IC8.N1(VSS) ; port VSS, port VSSQ  [also labelled VSSQ]
ZQ_U5: IC5.B9(ZQ) ; port ZQ_U5
ZQ_U6: IC6.B9(ZQ) ; port ZQ_U6
ZQ_U7: IC7.B9(ZQ) ; port ZQ_U7
ZQ_U8: IC8.B9(ZQ) ; port ZQ_U8

Not connected (* = marked no-connect by the designer): IC5 A3(NF,_NF/TDQS_c) F2(NC) G2(NC) G8(NC) G9(TEN) N7(A17/NC); IC6 A3(NF,_NF/TDQS_c) F2(NC) G2(NC) G8(NC) G9(TEN) N7(A17/NC); IC7 A3(NF,_NF/TDQS_c) F2(NC) G2(NC) G8(NC) G9(TEN) N7(A17/NC); IC8 A3(NF,_NF/TDQS_c) F2(NC) G2(NC) G8(NC) G9(TEN) N7(A17/NC)

### Layout directives
differential pair: DQS4_N, DQS4_P, DQS5_N, DQS5_P, DQS6_N, DQS6_P, DQS7_N, DQS7_P

### Notes on the sheet
- DRAM IC5 to IC8

## Sheet SPD and Alert.SchDoc
size A3
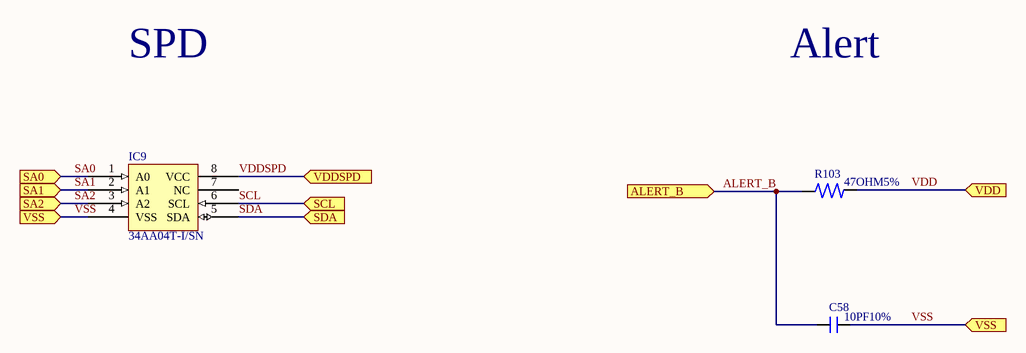
[diagram p4: SPD and Alert.SchDoc]

### Parts
C58  Capacitance: 10PF10%  [Capacitor 0402]  (hidden comment: Capacitor 0402)
IC9  34AA04T-I/SN  [34AA04T-I/SN]
R103  Resistance: 47OHM5%  [Resistor 0402]  (hidden comment: Resistor 0402)

### Ports
ALERT_B (in), SA0 (in), SA1 (in), SA2 (in), SCL (in), SDA (in), VDD (in), VDDSPD (in), VSS (in)

### Nets
ALERT_B: C58.1 R103.1 ; port ALERT_B
SA0: IC9.1(A0) ; port SA0
SA1: IC9.2(A1) ; port SA1
SA2: IC9.3(A2) ; port SA2
SCL: IC9.6(SCL) ; port SCL
SDA: IC9.5(SDA) ; port SDA
VDD: R103.2 ; port VDD
VDDSPD: IC9.8(VCC) ; port VDDSPD
VSS: C58.2 IC9.4(VSS) ; port VSS

Not connected (* = marked no-connect by the designer): IC9 7(NC)

### Notes on the sheet
- SPD
- Alert

### Library data of the parts
C58 = Capacitor 0201: as C1 on sheet Address Termination; Supplier 1: Avnet Europe; Stock 1: 305000; Pricing 1: 5000=0.00444, 10000=0.00432, 20000=0.00421, 30000=0.0041, 40000=0.004 (EUR); Case/Package: 0201; Number of Pins: 2; Weight: 7.1E-05oz; Contact Plating: Tin,Lead; Case Code (Metric): 0603; Case Code (Imperial): 0201; Min Operating Temperature: -55°C; Max Operating Temperature: 155°C; Packaging: Tape and Reel; Package Quantity: 10; Termination: SMD/SMT; Power Rating: 100mW; Composition: Thick Film; Number of Terminations: 2; Military Standard: Not; Voltage Rating (DC): 75V; Features: Automotive AEC-Q200; Length: 1.55mm; Height: 0.45mm; Width: 0.033inch; Depth: 0.85mm; Radiation Hardening: No; REACH SVHC: Unknown; Lead Free: Lead Free
R103 = Resistor 0201: as R97 on sheet Address Termination; Supplier 1: Avnet Europe; Stock 1: 305000; Pricing 1: 5000=0.00444, 10000=0.00432, 20000=0.00421, 30000=0.0041, 40000=0.004 (EUR); Case/Package: 0201; Number of Pins: 2; Weight: 7.1E-05oz; Contact Plating: Tin,Lead; Case Code (Metric): 0603; Case Code (Imperial): 0201; Min Operating Temperature: -55°C; Max Operating Temperature: 155°C; Packaging: Tape and Reel; Package Quantity: 10; Termination: SMD/SMT; Power Rating: 100mW; Composition: Thick Film; Number of Terminations: 2; Military Standard: Not; Voltage Rating (DC): 75V; Features: Automotive AEC-Q200; Length: 1.55mm; Height: 0.45mm; Width: 0.033inch; Depth: 0.85mm; Radiation Hardening: No; REACH SVHC: Unknown; Lead Free: Lead Free; ComponentLink1URL: http://www.vishay.com/docs/20008/dcrcw.pdf?src-supplier=Avnet+Europe; ComponentLink1Description: http://www.vishay.com/docs/20008/dcrcw.pdf?src-supplier=Avnet+Europe; ComponentLink2URL: https://www.verical.com/server-webapp/html/getDatasheet?partID=86831&src-supplier=Verical; ComponentLink2Description: https://www.verical.com/server-webapp/html/getDatasheet?partID=86831&src-supplier=Verical; ComponentLink3URL: http://www.farnell.com/datasheets/2310790.pdf?src-supplier=Allied+Electronics; ComponentLink3Description: http://www.farnell.com/datasheets/2310790.pdf?src-supplier=Allied+Electronics; ComponentLink4URL: http://www.vishay.com/docs/20035/dcrcwe3.pdf?src-supplier=Digi-Key; ComponentLink4Description: http://www.vishay.com/docs/20035/dcrcwe3.pdf?src-supplier=Digi-Key; ComponentLink5URL: http://www.farnell.com/datasheets/2310790.pdf?src-supplier=Mouser; ComponentLink5Description: http://www.farnell.com/datasheets/2310790.pdf?src-supplier=Mouser; ComponentLink6URL: http://www.farnell.com/datasheets/2310790.pdf?src-supplier=Element14; ComponentLink6Description: http://www.farnell.com/datasheets/2310790.pdf?src-supplier=Element14; ComponentLink7URL: http://www.farnell.com/datasheets/2310790.pdf?src-supplier=Avnet; ComponentLink7Description: http://www.farnell.com/datasheets/2310790.pdf?src-supplier=Avnet; ComponentLink8URL: http://www.vishay.com/docs/20035/dcrcwe3.pdf?src-supplier=Future+Electronics; ComponentLink8Description: http://www.vishay.com/docs/20035/dcrcwe3.pdf?src-supplier=Future+Electronics; ComponentLink9URL: http://uk.rs-online.com/webdocs/0d98/0900766b80d98afc.pdf?src-supplier=RSComponents; ComponentLink9Description: http://uk.rs-online.com/webdocs/0d98/0900766b80d98afc.pdf?src-supplier=RSComponents; ComponentLink10URL: http://www.farnell.com/datasheets/2310790.pdf?src-supplier=Distrelec; ComponentLink10Description: http://www.farnell.com/datasheets/2310790.pdf?src-supplier=Distrelec

## Sheet Stub Termination.SchDoc
size A3
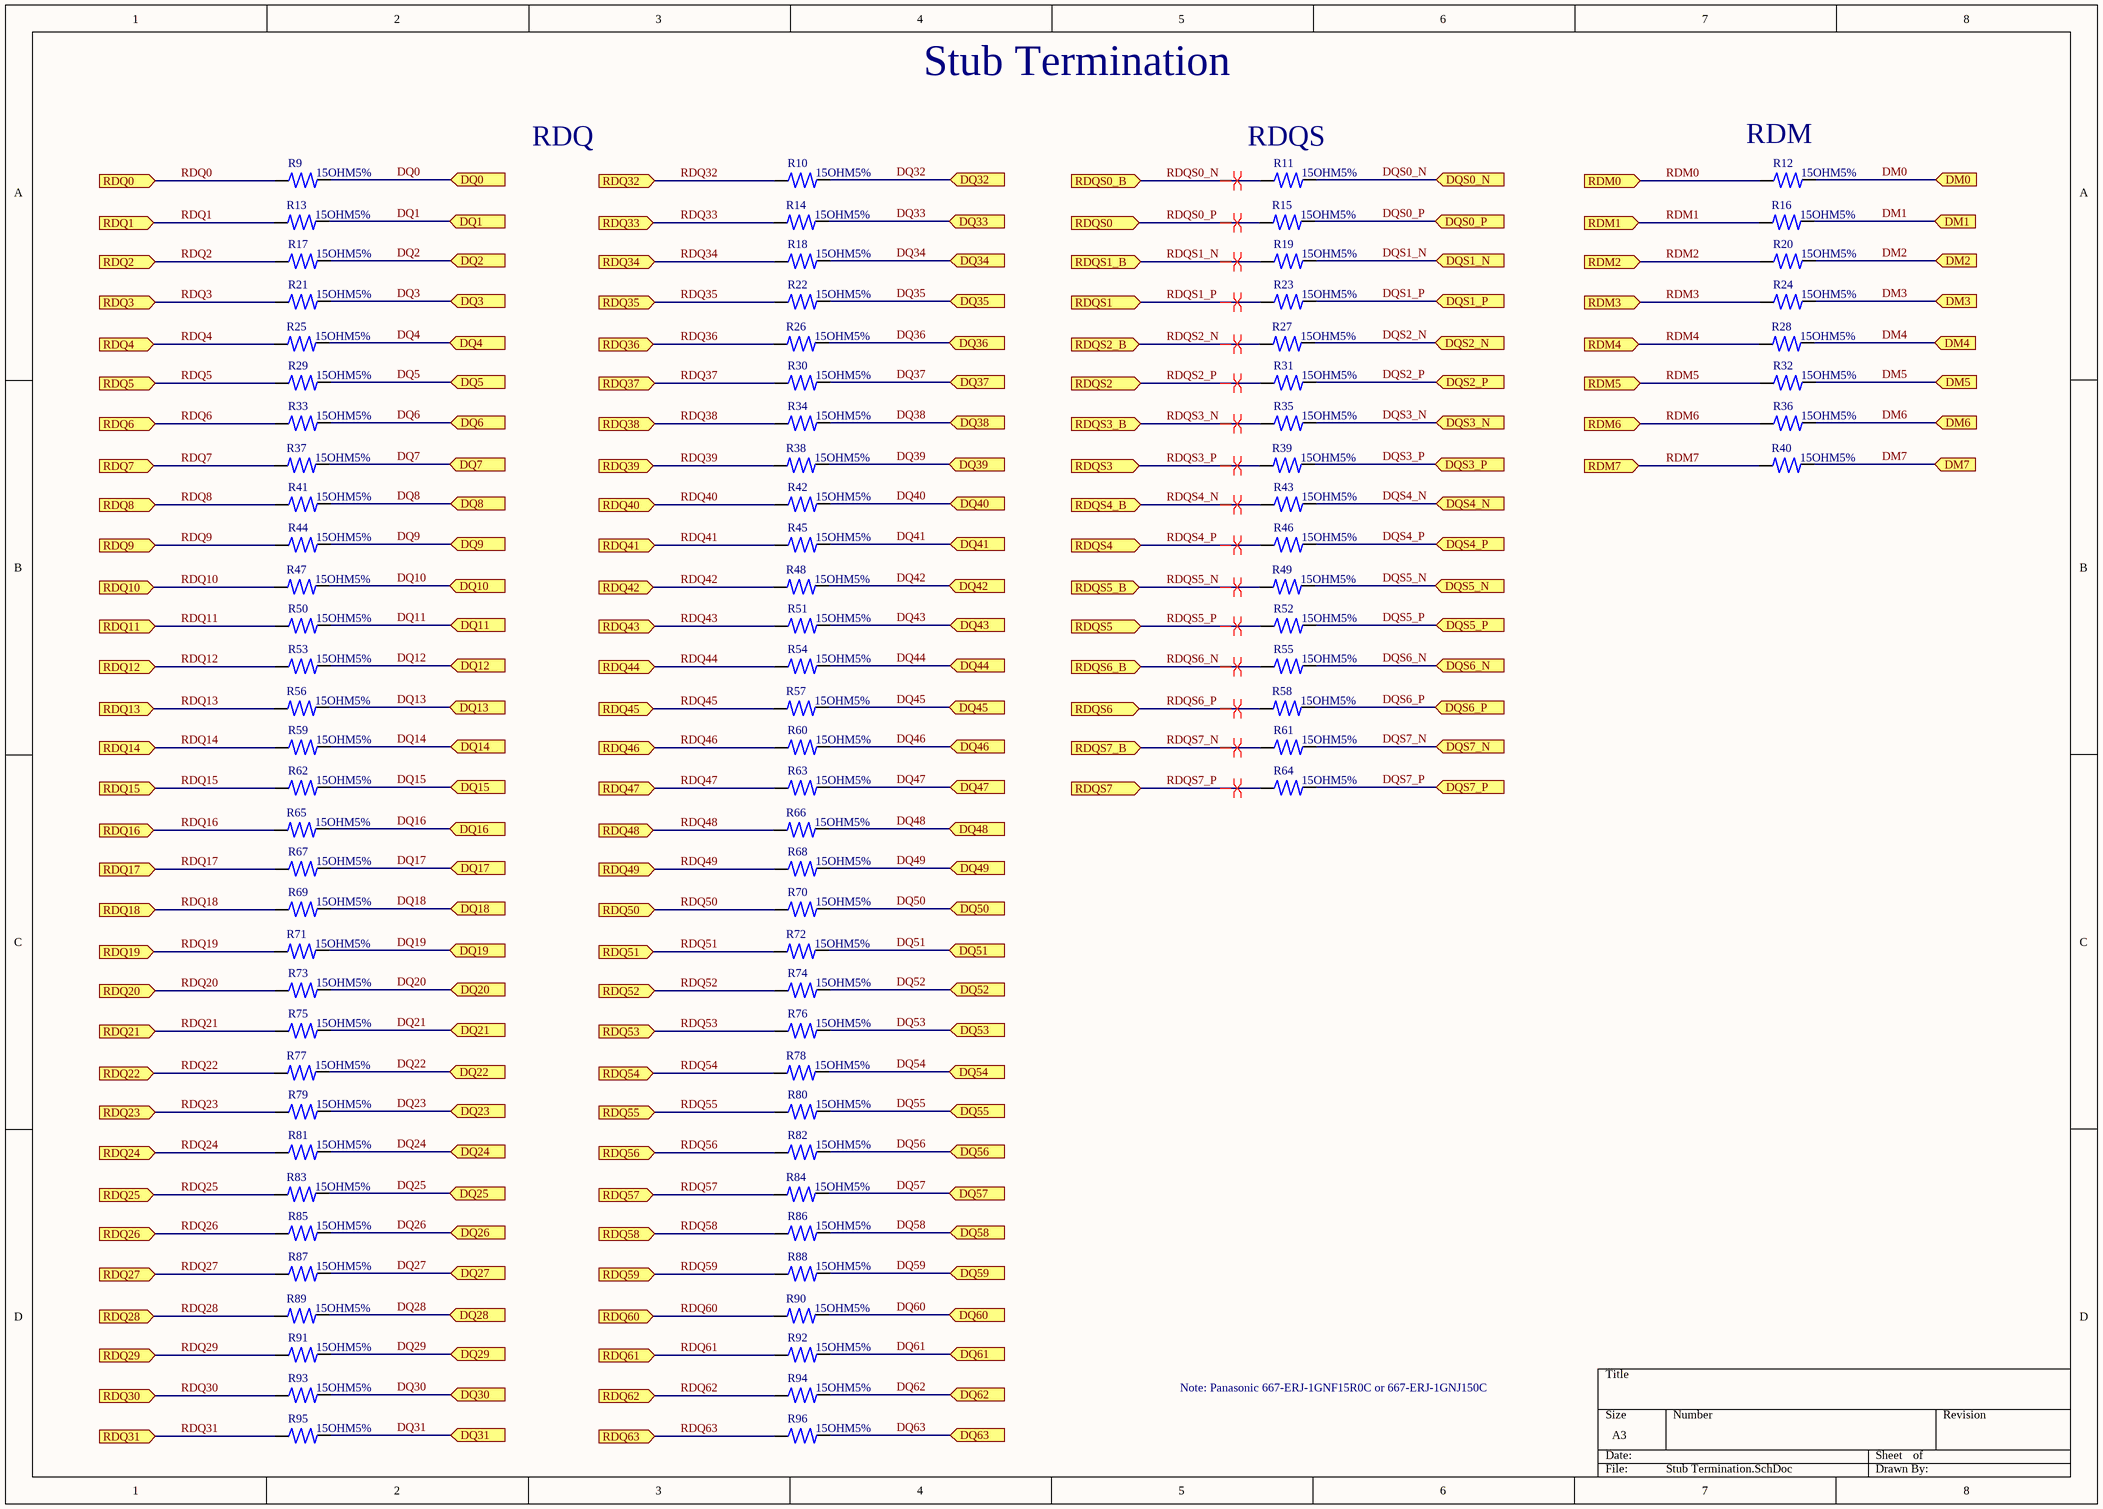
[diagram p5: Stub Termination.SchDoc]

### Parts
R9  Resistance: 15OHM5%  [Resistor 0402]  (hidden comment: Resistor 0402)
R10  Resistance: 15OHM5%  [Resistor 0402]  (hidden comment: Resistor 0402)
R11  Resistance: 15OHM5%  [Resistor 0402]  (hidden comment: Resistor 0402)
R12  Resistance: 15OHM5%  [Resistor 0402]  (hidden comment: Resistor 0402)
R13  Resistance: 15OHM5%  [Resistor 0402]  (hidden comment: Resistor 0402)
R14  Resistance: 15OHM5%  [Resistor 0402]  (hidden comment: Resistor 0402)
R15  Resistance: 15OHM5%  [Resistor 0402]  (hidden comment: Resistor 0402)
R16  Resistance: 15OHM5%  [Resistor 0402]  (hidden comment: Resistor 0402)
R17  Resistance: 15OHM5%  [Resistor 0402]  (hidden comment: Resistor 0402)
R18  Resistance: 15OHM5%  [Resistor 0402]  (hidden comment: Resistor 0402)
R19  Resistance: 15OHM5%  [Resistor 0402]  (hidden comment: Resistor 0402)
R20  Resistance: 15OHM5%  [Resistor 0402]  (hidden comment: Resistor 0402)
R21  Resistance: 15OHM5%  [Resistor 0402]  (hidden comment: Resistor 0402)
R22  Resistance: 15OHM5%  [Resistor 0402]  (hidden comment: Resistor 0402)
R23  Resistance: 15OHM5%  [Resistor 0402]  (hidden comment: Resistor 0402)
R24  Resistance: 15OHM5%  [Resistor 0402]  (hidden comment: Resistor 0402)
R25  Resistance: 15OHM5%  [Resistor 0402]  (hidden comment: Resistor 0402)
R26  Resistance: 15OHM5%  [Resistor 0402]  (hidden comment: Resistor 0402)
R27  Resistance: 15OHM5%  [Resistor 0402]  (hidden comment: Resistor 0402)
R28  Resistance: 15OHM5%  [Resistor 0402]  (hidden comment: Resistor 0402)
R29  Resistance: 15OHM5%  [Resistor 0402]  (hidden comment: Resistor 0402)
R30  Resistance: 15OHM5%  [Resistor 0402]  (hidden comment: Resistor 0402)
R31  Resistance: 15OHM5%  [Resistor 0402]  (hidden comment: Resistor 0402)
R32  Resistance: 15OHM5%  [Resistor 0402]  (hidden comment: Resistor 0402)
R33  Resistance: 15OHM5%  [Resistor 0402]  (hidden comment: Resistor 0402)
R34  Resistance: 15OHM5%  [Resistor 0402]  (hidden comment: Resistor 0402)
R35  Resistance: 15OHM5%  [Resistor 0402]  (hidden comment: Resistor 0402)
R36  Resistance: 15OHM5%  [Resistor 0402]  (hidden comment: Resistor 0402)
R37  Resistance: 15OHM5%  [Resistor 0402]  (hidden comment: Resistor 0402)
R38  Resistance: 15OHM5%  [Resistor 0402]  (hidden comment: Resistor 0402)
R39  Resistance: 15OHM5%  [Resistor 0402]  (hidden comment: Resistor 0402)
R40  Resistance: 15OHM5%  [Resistor 0402]  (hidden comment: Resistor 0402)
R41  Resistance: 15OHM5%  [Resistor 0402]  (hidden comment: Resistor 0402)
R42  Resistance: 15OHM5%  [Resistor 0402]  (hidden comment: Resistor 0402)
R43  Resistance: 15OHM5%  [Resistor 0402]  (hidden comment: Resistor 0402)
R44  Resistance: 15OHM5%  [Resistor 0402]  (hidden comment: Resistor 0402)
R45  Resistance: 15OHM5%  [Resistor 0402]  (hidden comment: Resistor 0402)
R46  Resistance: 15OHM5%  [Resistor 0402]  (hidden comment: Resistor 0402)
R47  Resistance: 15OHM5%  [Resistor 0402]  (hidden comment: Resistor 0402)
R48  Resistance: 15OHM5%  [Resistor 0402]  (hidden comment: Resistor 0402)
R49  Resistance: 15OHM5%  [Resistor 0402]  (hidden comment: Resistor 0402)
R50  Resistance: 15OHM5%  [Resistor 0402]  (hidden comment: Resistor 0402)
R51  Resistance: 15OHM5%  [Resistor 0402]  (hidden comment: Resistor 0402)
R52  Resistance: 15OHM5%  [Resistor 0402]  (hidden comment: Resistor 0402)
R53  Resistance: 15OHM5%  [Resistor 0402]  (hidden comment: Resistor 0402)
R54  Resistance: 15OHM5%  [Resistor 0402]  (hidden comment: Resistor 0402)
R55  Resistance: 15OHM5%  [Resistor 0402]  (hidden comment: Resistor 0402)
R56  Resistance: 15OHM5%  [Resistor 0402]  (hidden comment: Resistor 0402)
R57  Resistance: 15OHM5%  [Resistor 0402]  (hidden comment: Resistor 0402)
R58  Resistance: 15OHM5%  [Resistor 0402]  (hidden comment: Resistor 0402)
R59  Resistance: 15OHM5%  [Resistor 0402]  (hidden comment: Resistor 0402)
R60  Resistance: 15OHM5%  [Resistor 0402]  (hidden comment: Resistor 0402)
R61  Resistance: 15OHM5%  [Resistor 0402]  (hidden comment: Resistor 0402)
R62  Resistance: 15OHM5%  [Resistor 0402]  (hidden comment: Resistor 0402)
R63  Resistance: 15OHM5%  [Resistor 0402]  (hidden comment: Resistor 0402)
R64  Resistance: 15OHM5%  [Resistor 0402]  (hidden comment: Resistor 0402)
R65  Resistance: 15OHM5%  [Resistor 0402]  (hidden comment: Resistor 0402)
R66  Resistance: 15OHM5%  [Resistor 0402]  (hidden comment: Resistor 0402)
R67  Resistance: 15OHM5%  [Resistor 0402]  (hidden comment: Resistor 0402)
R68  Resistance: 15OHM5%  [Resistor 0402]  (hidden comment: Resistor 0402)
R69  Resistance: 15OHM5%  [Resistor 0402]  (hidden comment: Resistor 0402)
R70  Resistance: 15OHM5%  [Resistor 0402]  (hidden comment: Resistor 0402)
R71  Resistance: 15OHM5%  [Resistor 0402]  (hidden comment: Resistor 0402)
R72  Resistance: 15OHM5%  [Resistor 0402]  (hidden comment: Resistor 0402)
R73  Resistance: 15OHM5%  [Resistor 0402]  (hidden comment: Resistor 0402)
R74  Resistance: 15OHM5%  [Resistor 0402]  (hidden comment: Resistor 0402)
R75  Resistance: 15OHM5%  [Resistor 0402]  (hidden comment: Resistor 0402)
R76  Resistance: 15OHM5%  [Resistor 0402]  (hidden comment: Resistor 0402)
R77  Resistance: 15OHM5%  [Resistor 0402]  (hidden comment: Resistor 0402)
R78  Resistance: 15OHM5%  [Resistor 0402]  (hidden comment: Resistor 0402)
R79  Resistance: 15OHM5%  [Resistor 0402]  (hidden comment: Resistor 0402)
R80  Resistance: 15OHM5%  [Resistor 0402]  (hidden comment: Resistor 0402)
R81  Resistance: 15OHM5%  [Resistor 0402]  (hidden comment: Resistor 0402)
R82  Resistance: 15OHM5%  [Resistor 0402]  (hidden comment: Resistor 0402)
R83  Resistance: 15OHM5%  [Resistor 0402]  (hidden comment: Resistor 0402)
R84  Resistance: 15OHM5%  [Resistor 0402]  (hidden comment: Resistor 0402)
R85  Resistance: 15OHM5%  [Resistor 0402]  (hidden comment: Resistor 0402)
R86  Resistance: 15OHM5%  [Resistor 0402]  (hidden comment: Resistor 0402)
R87  Resistance: 15OHM5%  [Resistor 0402]  (hidden comment: Resistor 0402)
R88  Resistance: 15OHM5%  [Resistor 0402]  (hidden comment: Resistor 0402)
R89  Resistance: 15OHM5%  [Resistor 0402]  (hidden comment: Resistor 0402)
R90  Resistance: 15OHM5%  [Resistor 0402]  (hidden comment: Resistor 0402)
R91  Resistance: 15OHM5%  [Resistor 0402]  (hidden comment: Resistor 0402)
R92  Resistance: 15OHM5%  [Resistor 0402]  (hidden comment: Resistor 0402)
R93  Resistance: 15OHM5%  [Resistor 0402]  (hidden comment: Resistor 0402)
R94  Resistance: 15OHM5%  [Resistor 0402]  (hidden comment: Resistor 0402)
R95  Resistance: 15OHM5%  [Resistor 0402]  (hidden comment: Resistor 0402)
R96  Resistance: 15OHM5%  [Resistor 0402]  (hidden comment: Resistor 0402)

### Ports
DM0 (in), DM1 (in), DM2 (in), DM3 (in), DM4 (in), DM5 (in), DM6 (in), DM7 (in), DQ0 (in), DQ1 (in), DQ2 (in), DQ3 (in), DQ4 (in), DQ5 (in), DQ6 (in), DQ7 (in), DQ8 (in), DQ9 (in), DQ10 (in), DQ11 (in), DQ12 (in), DQ13 (in), DQ14 (in), DQ15 (in), DQ16 (in), DQ17 (in), DQ18 (in), DQ19 (in), DQ20 (in), DQ21 (in), DQ22 (in), DQ23 (in), DQ24 (in), DQ25 (in), DQ26 (in), DQ27 (in), DQ28 (in), DQ29 (in), DQ30 (in), DQ31 (in), DQ32 (in), DQ33 (in), DQ34 (in), DQ35 (in), DQ36 (in), DQ37 (in), DQ38 (in), DQ39 (in), DQ40 (in), DQ41 (in), DQ42 (in), DQ43 (in), DQ44 (in), DQ45 (in), DQ46 (in), DQ47 (in), DQ48 (in), DQ49 (in), DQ50 (in), DQ51 (in), DQ52 (in), DQ53 (in), DQ54 (in), DQ55 (in), DQ56 (in), DQ57 (in), DQ58 (in), DQ59 (in), DQ60 (in), DQ61 (in), DQ62 (in), DQ63 (in), DQS0_N (in), DQS0_P (in), DQS1_N (in), DQS1_P (in), DQS2_N (in), DQS2_P (in), DQS3_N (in), DQS3_P (in), DQS4_N (in), DQS4_P (in), DQS5_N (in), DQS5_P (in), DQS6_N (in), DQS6_P (in), DQS7_N (in), DQS7_P (in), RDM0 (in), RDM1 (in), RDM2 (in), RDM3 (in), RDM4 (in), RDM5 (in), RDM6 (in), RDM7 (in), RDQ0 (in), RDQ1 (in), RDQ2 (in), RDQ3 (in), RDQ4 (in), RDQ5 (in), RDQ6 (in), RDQ7 (in), RDQ8 (in), RDQ9 (in), RDQ10 (in), RDQ11 (in), RDQ12 (in), RDQ13 (in), RDQ14 (in), RDQ15 (in), RDQ16 (in), RDQ17 (in), RDQ18 (in), RDQ19 (in), RDQ20 (in), RDQ21 (in), RDQ22 (in), RDQ23 (in), RDQ24 (in), RDQ25 (in), RDQ26 (in), RDQ27 (in), RDQ28 (in), RDQ29 (in), RDQ30 (in), RDQ31 (in), RDQ32 (in), RDQ33 (in), RDQ34 (in), RDQ35 (in), RDQ36 (in), RDQ37 (in), RDQ38 (in), RDQ39 (in), RDQ40 (in), RDQ41 (in), RDQ42 (in), RDQ43 (in), RDQ44 (in), RDQ45 (in), RDQ46 (in), RDQ47 (in), RDQ48 (in), RDQ49 (in), RDQ50 (in), RDQ51 (in), RDQ52 (in), RDQ53 (in), RDQ54 (in), RDQ55 (in), RDQ56 (in), RDQ57 (in), RDQ58 (in), RDQ59 (in), RDQ60 (in), RDQ61 (in), RDQ62 (in), RDQ63 (in), RDQS0 (in), RDQS0_B (in), RDQS1 (in), RDQS1_B (in), RDQS2 (in), RDQS2_B (in), RDQS3 (in), RDQS3_B (in), RDQS4 (in), RDQS4_B (in), RDQS5 (in), RDQS5_B (in), RDQS6 (in), RDQS6_B (in), RDQS7 (in), RDQS7_B (in)

### Nets
DM0: R12.2 ; port DM0
DM1: R16.2 ; port DM1
DM2: R20.2 ; port DM2
DM3: R24.2 ; port DM3
DM4: R28.2 ; port DM4
DM5: R32.2 ; port DM5
DM6: R36.2 ; port DM6
DM7: R40.2 ; port DM7
DQ0: R9.2 ; port DQ0
DQ1: R13.2 ; port DQ1
DQ2: R17.2 ; port DQ2
DQ3: R21.2 ; port DQ3
DQ4: R25.2 ; port DQ4
DQ5: R29.2 ; port DQ5
DQ6: R33.2 ; port DQ6
DQ7: R37.2 ; port DQ7
DQ8: R41.2 ; port DQ8
DQ9: R44.2 ; port DQ9
DQ10: R47.2 ; port DQ10
DQ11: R50.2 ; port DQ11
DQ12: R53.2 ; port DQ12
DQ13: R56.2 ; port DQ13
DQ14: R59.2 ; port DQ14
DQ15: R62.2 ; port DQ15
DQ16: R65.2 ; port DQ16
DQ17: R67.2 ; port DQ17
DQ18: R69.2 ; port DQ18
DQ19: R71.2 ; port DQ19
DQ20: R73.2 ; port DQ20
DQ21: R75.2 ; port DQ21
DQ22: R77.2 ; port DQ22
DQ23: R79.2 ; port DQ23
DQ24: R81.2 ; port DQ24
DQ25: R83.2 ; port DQ25
DQ26: R85.2 ; port DQ26
DQ27: R87.2 ; port DQ27
DQ28: R89.2 ; port DQ28
DQ29: R91.2 ; port DQ29
DQ30: R93.2 ; port DQ30
DQ31: R95.2 ; port DQ31
DQ32: R10.2 ; port DQ32
DQ33: R14.2 ; port DQ33
DQ34: R18.2 ; port DQ34
DQ35: R22.2 ; port DQ35
DQ36: R26.2 ; port DQ36
DQ37: R30.2 ; port DQ37
DQ38: R34.2 ; port DQ38
DQ39: R38.2 ; port DQ39
DQ40: R42.2 ; port DQ40
DQ41: R45.2 ; port DQ41
DQ42: R48.2 ; port DQ42
DQ43: R51.2 ; port DQ43
DQ44: R54.2 ; port DQ44
DQ45: R57.2 ; port DQ45
DQ46: R60.2 ; port DQ46
DQ47: R63.2 ; port DQ47
DQ48: R66.2 ; port DQ48
DQ49: R68.2 ; port DQ49
DQ50: R70.2 ; port DQ50
DQ51: R72.2 ; port DQ51
DQ52: R74.2 ; port DQ52
DQ53: R76.2 ; port DQ53
DQ54: R78.2 ; port DQ54
DQ55: R80.2 ; port DQ55
DQ56: R82.2 ; port DQ56
DQ57: R84.2 ; port DQ57
DQ58: R86.2 ; port DQ58
DQ59: R88.2 ; port DQ59
DQ60: R90.2 ; port DQ60
DQ61: R92.2 ; port DQ61
DQ62: R94.2 ; port DQ62
DQ63: R96.2 ; port DQ63
DQS0_N: R11.2 ; port DQS0_N
DQS0_P: R15.2 ; port DQS0_P
DQS1_N: R19.2 ; port DQS1_N
DQS1_P: R23.2 ; port DQS1_P
DQS2_N: R27.2 ; port DQS2_N
DQS2_P: R31.2 ; port DQS2_P
DQS3_N: R35.2 ; port DQS3_N
DQS3_P: R39.2 ; port DQS3_P
DQS4_N: R43.2 ; port DQS4_N
DQS4_P: R46.2 ; port DQS4_P
DQS5_N: R49.2 ; port DQS5_N
DQS5_P: R52.2 ; port DQS5_P
DQS6_N: R55.2 ; port DQS6_N
DQS6_P: R58.2 ; port DQS6_P
DQS7_N: R61.2 ; port DQS7_N
DQS7_P: R64.2 ; port DQS7_P
RDM0: R12.1 ; port RDM0
RDM1: R16.1 ; port RDM1
RDM2: R20.1 ; port RDM2
RDM3: R24.1 ; port RDM3
RDM4: R28.1 ; port RDM4
RDM5: R32.1 ; port RDM5
RDM6: R36.1 ; port RDM6
RDM7: R40.1 ; port RDM7
RDQ0: R9.1 ; port RDQ0
RDQ1: R13.1 ; port RDQ1
RDQ2: R17.1 ; port RDQ2
RDQ3: R21.1 ; port RDQ3
RDQ4: R25.1 ; port RDQ4
RDQ5: R29.1 ; port RDQ5
RDQ6: R33.1 ; port RDQ6
RDQ7: R37.1 ; port RDQ7
RDQ8: R41.1 ; port RDQ8
RDQ9: R44.1 ; port RDQ9
RDQ10: R47.1 ; port RDQ10
RDQ11: R50.1 ; port RDQ11
RDQ12: R53.1 ; port RDQ12
RDQ13: R56.1 ; port RDQ13
RDQ14: R59.1 ; port RDQ14
RDQ15: R62.1 ; port RDQ15
RDQ16: R65.1 ; port RDQ16
RDQ17: R67.1 ; port RDQ17
RDQ18: R69.1 ; port RDQ18
RDQ19: R71.1 ; port RDQ19
RDQ20: R73.1 ; port RDQ20
RDQ21: R75.1 ; port RDQ21
RDQ22: R77.1 ; port RDQ22
RDQ23: R79.1 ; port RDQ23
RDQ24: R81.1 ; port RDQ24
RDQ25: R83.1 ; port RDQ25
RDQ26: R85.1 ; port RDQ26
RDQ27: R87.1 ; port RDQ27
RDQ28: R89.1 ; port RDQ28
RDQ29: R91.1 ; port RDQ29
RDQ30: R93.1 ; port RDQ30
RDQ31: R95.1 ; port RDQ31
RDQ32: R10.1 ; port RDQ32
RDQ33: R14.1 ; port RDQ33
RDQ34: R18.1 ; port RDQ34
RDQ35: R22.1 ; port RDQ35
RDQ36: R26.1 ; port RDQ36
RDQ37: R30.1 ; port RDQ37
RDQ38: R34.1 ; port RDQ38
RDQ39: R38.1 ; port RDQ39
RDQ40: R42.1 ; port RDQ40
RDQ41: R45.1 ; port RDQ41
RDQ42: R48.1 ; port RDQ42
RDQ43: R51.1 ; port RDQ43
RDQ44: R54.1 ; port RDQ44
RDQ45: R57.1 ; port RDQ45
RDQ46: R60.1 ; port RDQ46
RDQ47: R63.1 ; port RDQ47
RDQ48: R66.1 ; port RDQ48
RDQ49: R68.1 ; port RDQ49
RDQ50: R70.1 ; port RDQ50
RDQ51: R72.1 ; port RDQ51
RDQ52: R74.1 ; port RDQ52
RDQ53: R76.1 ; port RDQ53
RDQ54: R78.1 ; port RDQ54
RDQ55: R80.1 ; port RDQ55
RDQ56: R82.1 ; port RDQ56
RDQ57: R84.1 ; port RDQ57
RDQ58: R86.1 ; port RDQ58
RDQ59: R88.1 ; port RDQ59
RDQ60: R90.1 ; port RDQ60
RDQ61: R92.1 ; port RDQ61
RDQ62: R94.1 ; port RDQ62
RDQ63: R96.1 ; port RDQ63
RDQS0_N: R11.1 ; port RDQS0_B
RDQS0_P: R15.1 ; port RDQS0
RDQS1_N: R19.1 ; port RDQS1_B
RDQS1_P: R23.1 ; port RDQS1
RDQS2_N: R27.1 ; port RDQS2_B
RDQS2_P: R31.1 ; port RDQS2
RDQS3_N: R35.1 ; port RDQS3_B
RDQS3_P: R39.1 ; port RDQS3
RDQS4_N: R43.1 ; port RDQS4_B
RDQS4_P: R46.1 ; port RDQS4
RDQS5_N: R49.1 ; port RDQS5_B
RDQS5_P: R52.1 ; port RDQS5
RDQS6_N: R55.1 ; port RDQS6_B
RDQS6_P: R58.1 ; port RDQS6
RDQS7_N: R61.1 ; port RDQS7_B
RDQS7_P: R64.1 ; port RDQS7

### Layout directives
differential pair: RDQS0_N, RDQS0_P, RDQS1_N, RDQS1_P, RDQS2_N, RDQS2_P, RDQS3_N, RDQS3_P, RDQS4_N, RDQS4_P, RDQS5_N, RDQS5_P, RDQS6_N, RDQS6_P, RDQS7_N, RDQS7_P

### Notes on the sheet
- Stub Termination
- RDQ
- (near R11) RDQS
- (near R12) RDM
- Note: Panasonic 667-ERJ-1GNF15R0C or 667-ERJ-1GNJ150C

### Library data of the parts
R9-R96 = Resistor 0201: as R97 on sheet Address Termination; Supplier 1: Avnet Europe; Stock 1: 305000; Pricing 1: 5000=0.00444, 10000=0.00432, 20000=0.00421, 30000=0.0041, 40000=0.004 (EUR); Case/Package: 0201; Number of Pins: 2; Weight: 7.1E-05oz; Contact Plating: Tin,Lead; Case Code (Metric): 0603; Case Code (Imperial): 0201; Min Operating Temperature: -55°C; Max Operating Temperature: 155°C; Packaging: Tape and Reel; Package Quantity: 10; Termination: SMD/SMT; Power Rating: 100mW; Composition: Thick Film; Number of Terminations: 2; Military Standard: Not; Voltage Rating (DC): 75V; Features: Automotive AEC-Q200; Length: 1.55mm; Height: 0.45mm; Width: 0.033inch; Depth: 0.85mm; Radiation Hardening: No; REACH SVHC: Unknown; Lead Free: Lead Free; ComponentLink1URL: http://www.vishay.com/docs/20008/dcrcw.pdf?src-supplier=Avnet+Europe; ComponentLink1Description: http://www.vishay.com/docs/20008/dcrcw.pdf?src-supplier=Avnet+Europe; ComponentLink2URL: https://www.verical.com/server-webapp/html/getDatasheet?partID=86831&src-supplier=Verical; ComponentLink2Description: https://www.verical.com/server-webapp/html/getDatasheet?partID=86831&src-supplier=Verical; ComponentLink3URL: http://www.farnell.com/datasheets/2310790.pdf?src-supplier=Allied+Electronics; ComponentLink3Description: http://www.farnell.com/datasheets/2310790.pdf?src-supplier=Allied+Electronics; ComponentLink4URL: http://www.vishay.com/docs/20035/dcrcwe3.pdf?src-supplier=Digi-Key; ComponentLink4Description: http://www.vishay.com/docs/20035/dcrcwe3.pdf?src-supplier=Digi-Key; ComponentLink5URL: http://www.farnell.com/datasheets/2310790.pdf?src-supplier=Mouser; ComponentLink5Description: http://www.farnell.com/datasheets/2310790.pdf?src-supplier=Mouser; ComponentLink6URL: http://www.farnell.com/datasheets/2310790.pdf?src-supplier=Element14; ComponentLink6Description: http://www.farnell.com/datasheets/2310790.pdf?src-supplier=Element14; ComponentLink7URL: http://www.farnell.com/datasheets/2310790.pdf?src-supplier=Avnet; ComponentLink7Description: http://www.farnell.com/datasheets/2310790.pdf?src-supplier=Avnet; ComponentLink8URL: http://www.vishay.com/docs/20035/dcrcwe3.pdf?src-supplier=Future+Electronics; ComponentLink8Description: http://www.vishay.com/docs/20035/dcrcwe3.pdf?src-supplier=Future+Electronics; ComponentLink9URL: http://uk.rs-online.com/webdocs/0d98/0900766b80d98afc.pdf?src-supplier=RSComponents; ComponentLink9Description: http://uk.rs-online.com/webdocs/0d98/0900766b80d98afc.pdf?src-supplier=RSComponents; ComponentLink10URL: http://www.farnell.com/datasheets/2310790.pdf?src-supplier=Distrelec; ComponentLink10Description: http://www.farnell.com/datasheets/2310790.pdf?src-supplier=Distrelec

## Sheet Fiducial Markers.SchDoc
size A
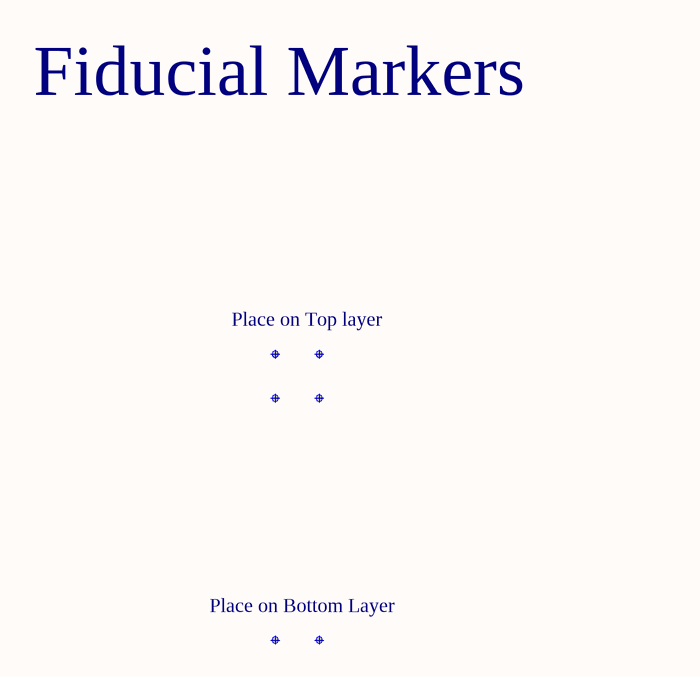
[diagram p6: Fiducial Markers.SchDoc]

### Parts
Fid1  Fiducial mark  [Fiducial_Round-Square]  (value not drawn)  (no BOM)
Fid2  Fiducial mark  [Fiducial_Round-Square]  (value not drawn)  (no BOM)
Fid3  Fiducial mark  [Fiducial_Round-Square]  (value not drawn)  (no BOM)
Fid4  Fiducial mark  [Fiducial_Round-Square]  (value not drawn)  (no BOM)
Fid5  Fiducial mark  [Fiducial_Round-Square]  (value not drawn)  (no BOM)
Fid6  Fiducial mark  [Fiducial_Round-Square]  (value not drawn)  (no BOM)

### Notes on the sheet
- Fiducial Markers
- Place on Top layer
- Place on Bottom Layer

### Library data of the parts
Fid1-Fid6 = Fiducial: Part Number: Fid-Mark-Round-Square; Artikkelnr Noca: N.A.; Manufacturer: *; Manufacturer Part Number: *; LatestRevisionDate: 2017-01-30; Pin Count: 1; Publisher: Nordic Semiconductor; Published: 2009-12-12; Value: *; Note: *; Footprint Doc: Fiducial; Part number IPS: N.A.; ComponentLink1URL: *; ComponentLink1Description: Datasheet; ComponentLink2URL: *; ComponentLink2Description: Supplier link; HelpURL: *; Supplier 1: *; Supplier Part Number 1: *; Supplier 2: *; Supplier Part Number 2: *